# EAGLE design Flight_Computer_Farsi (EAGLE 9.6.2)

## Sheet 1 of 2
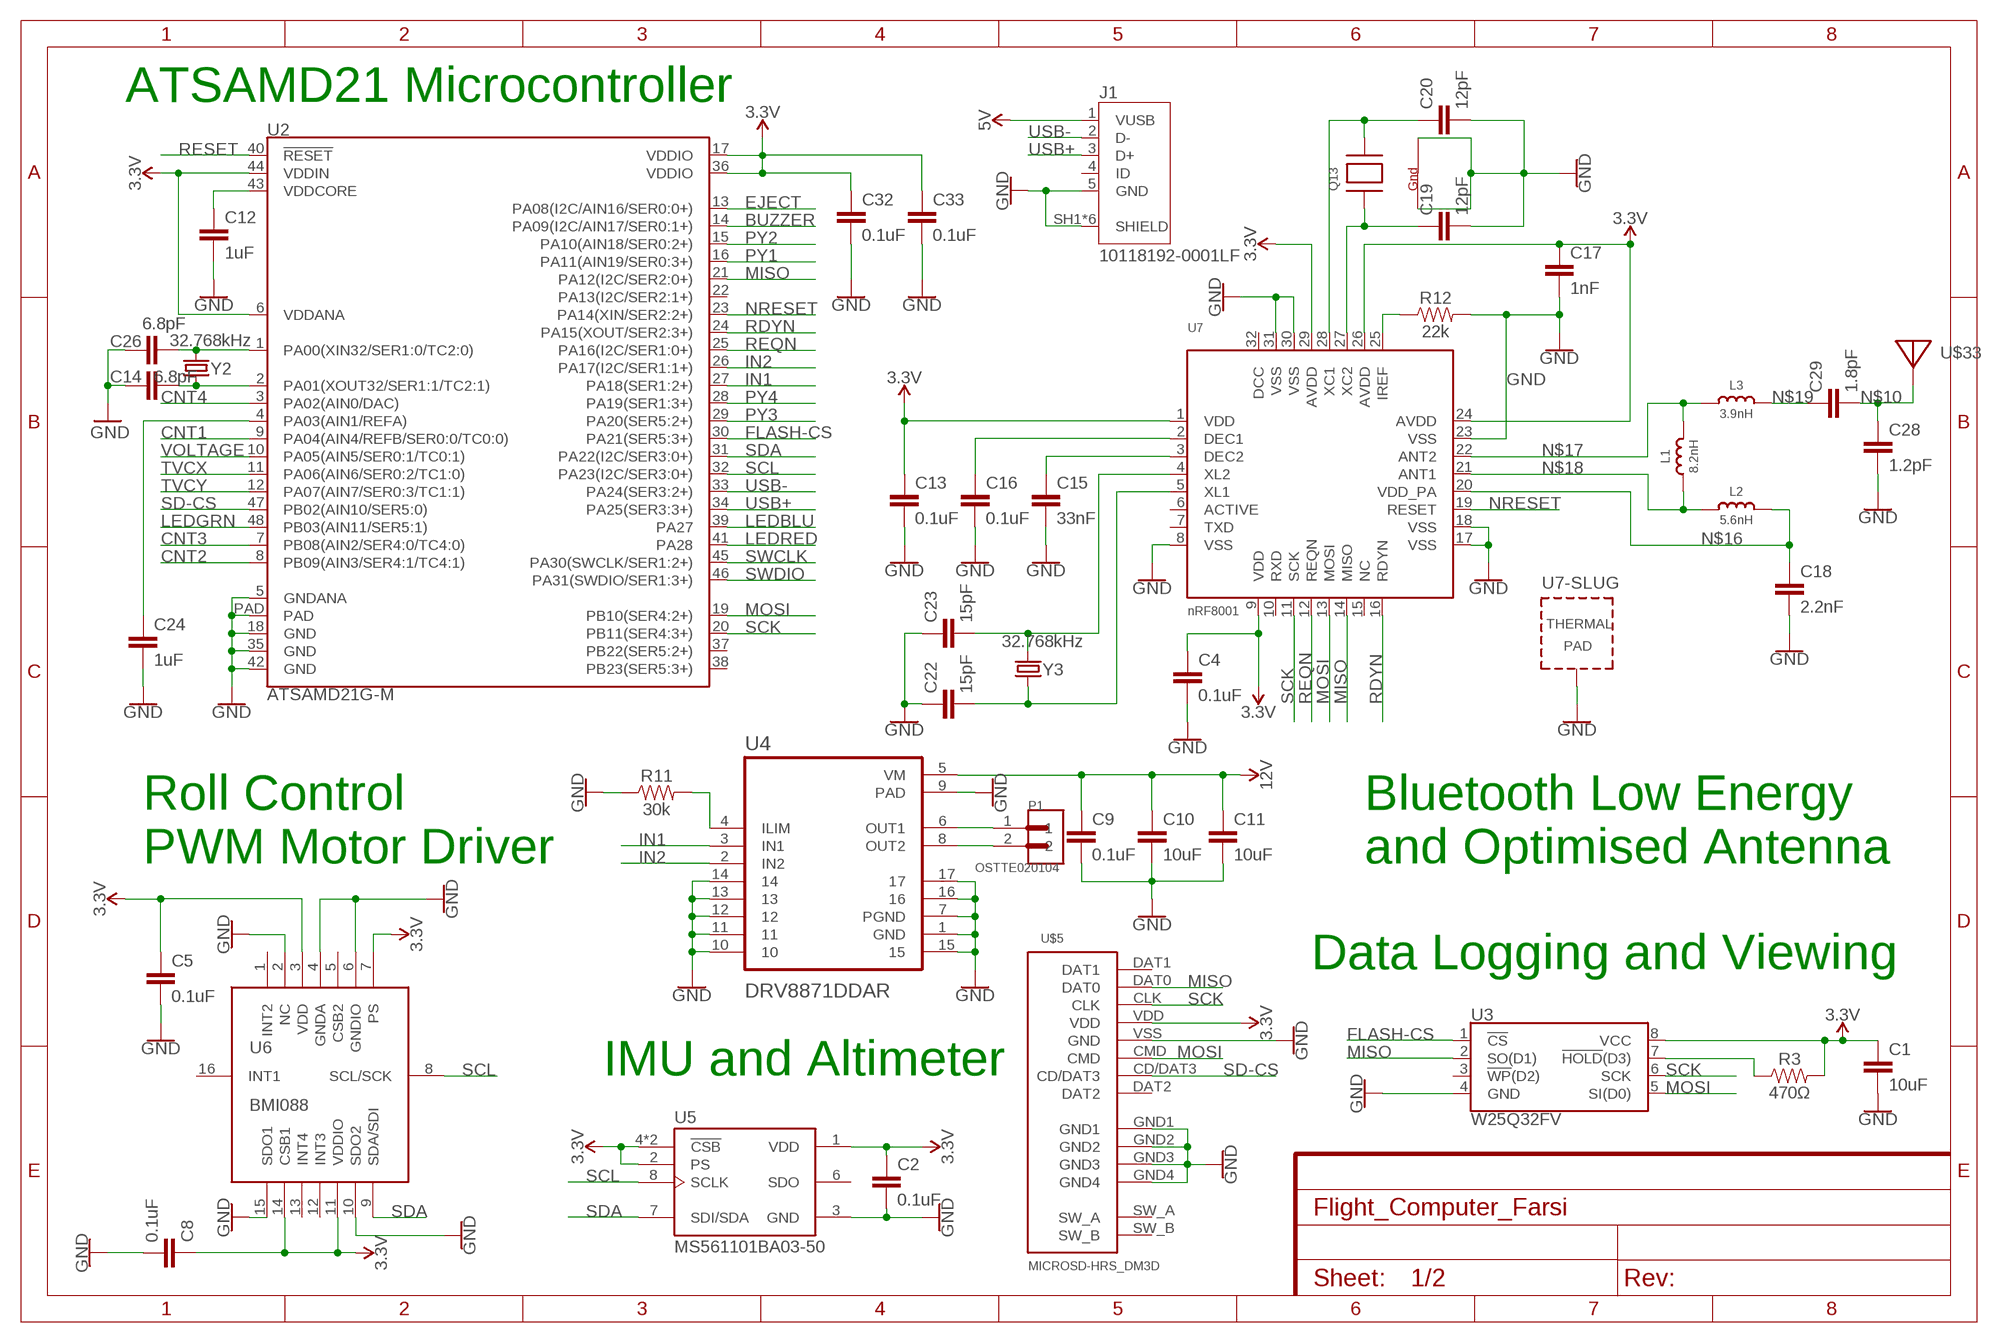
[diagram p0: schematic, sheet 1]

### Parts
C1  10uF  10UF-0603-6.3V-20%  [0603]
C2  0.1uF  0.1UF-0402-16V-10%  [0402]
C4  0.1uF  0.1UF-0402-16V-10%  [0402]
C5  0.1uF  0.1UF-0402-16V-10%  [0402]
C8  0.1uF  0.1UF-0402-16V-10%  [0402]
C9  0.1uF  0.1UF-0603-25V-5%  [0603]
C10  10uF  10UF-0603-6.3V-20%  [0603]
C11  10uF  10UF-0603-6.3V-20%  [0603]
C12  1uF  1.0UF-0603-16V-10%  [0603]
C13  0.1uF  0.1UF-0402-16V-10%  [0402]
C14  6.8pF  0.1UF-0603-25V-(+80/-20%)  [0603]
C15  33nF  0.1UF-0402-16V-10%  [0402]
C16  0.1uF  0.1UF-0402-16V-10%  [0402]
C17  1nF  0.1UF-0402-16V-10%  [0402]
C18  2.2nF  0.1UF-0402-16V-10%  [0402]
C19  12pF  0.1UF-0402-16V-10%  [0402]
C20  12pF  0.1UF-0402-16V-10%  [0402]
C22  15pF  0.1UF-0402-16V-10%  [0402]
C23  15pF  0.1UF-0402-16V-10%  [0402]
C24  1uF  1.0UF-0603-16V-10%  [0603]
C26  6.8pF  0.1UF-0603-25V-(+80/-20%)  [0603]
C28  1.2pF  0.1UF-0402-16V-10%  [0402]
C29  1.8pF  0.1UF-0402-16V-10%  [0402]
C32  0.1uF  0.1UF-0402-16V-10%  [0402]
C33  0.1uF  0.1UF-0402-16V-10%  [0402]
J1  10118192-0001LF  [AMPHENOL_10118192-0001LF]
L1  8.2nH  INDUCTOR_0402  [_0402]
L2  5.6nH  INDUCTOR_0402  [_0402]
L3  3.9nH  INDUCTOR_0402  [_0402]
P1  OSTTE020104  [OST_OSTTE020104]
Q13  XTAL-4-3225  [NX3225]
R3  470Ω  0OHM-0603-1/10W-5%  [0603]
R11  30k  10KOHM-0603-1/10W-1%  [0603]
R12  22k  22OHM-0402-1/10W-1%  [0402]
U2  ATSAMD21G-M  [QFN-48]
U3  W25Q32FV  W25Q32FVSS  [SOIC-8]
U4  DRV8871DDAR  [VREG_LM5017MR/NOPB]
U5  MS561101BA03-50  [SON125P500X300X100-8N]
U6  BMI088  [BMI088]
U7  nRF8001  NRF8001  [QFN32_5MM]
U$5  MICROSD-HRS_DM3D  [DM3D]
U$33  ANTENNA_PCBNRF8001_1.6MM_REV  [ANT_PCB_2.4GHZ_NRF8001_1.6MM_1OZ_REV]
Y2  32.768kHz  CRYSTAL3.2X1.5MM  [CRYSTAL-SMD-3.2X1.5MM]
Y3  32.768kHz  CRYSTAL3.2X1.5MM  [CRYSTAL-SMD-3.2X1.5MM]

### Nets
3.3V: C1.1 C2.1 C4.1 C5.1 C8.1 C13.1 C17.1 C32.1 C33.1 R3.2 U2.6(VDDANA) U2.17(VDDIO) U2.36(VDDIO) U2.44(VDDIN) U3.8(VCC) U5.1(VDD) U5.2(PS) U5.4(!CSB) U5.5(!CSB) U6.3(VDD) U6.7(PS) U6.11(VDDIO) U6.14(CSB1) U7.1(VDD) U7.9(VDD) U7.24(AVDD) U7.26(AVDD) U7.29(AVDD) U$5.VDD ; also sheet 2
5V: J1.1(VUSB) ; also sheet 2
12V: C9.1 C10.1 C11.1 U4.5(VM) ; also sheet 2
BUZZER: U2.14(PA09(I2C/AIN17/SER0:1+)) ; also sheet 2
CNT1: U2.9(PA04(AIN4/REFB/SER0:0/TC0:0)) ; also sheet 2
CNT2: U2.8(PB09(AIN3/SER4:1/TC4:1)) ; also sheet 2
CNT3: U2.7(PB08(AIN2/SER4:0/TC4:0)) ; also sheet 2
CNT4: U2.3(PA02(AIN0/DAC)) ; also sheet 2
EJECT: U2.13(PA08(I2C/AIN16/SER0:0+)) ; also sheet 2
FLASH-CS: U2.30(PA21(SER5:3+)) U3.1(!CS!)
GND: C1.2 C2.2 C4.2 C5.2 C8.2 C9.2 C10.2 C11.2 C12.2 C13.2 C14.1 C15.2 C16.2 C17.2 C18.2 C19.2 C20.2 C22.1 C23.1 C24.2 C26.1 C28.2 C32.2 C33.2 J1.5(GND) J1.SH1(SHIELD) J1.SH2(SHIELD) J1.SH3(SHIELD) J1.SH4(SHIELD) J1.SH5(SHIELD) J1.SH6(SHIELD) Q13.2(G2) Q13.4(G1) R11.1 R12.2 U2.5(GNDANA) U2.18(GND) U2.35(GND) U2.42(GND) U2.PAD U3.4(GND) U4.1(GND) U4.7(PGND) U4.9(PAD) U4.10 U4.11 U4.12 U4.13 U4.14 U4.15 U4.16 U4.17 U5.3(GND) U6.2(NC) U6.4(GNDA) U6.6(GNDIO) U6.10(SDO2) U6.15(SDO1) U7.8(VSS) U7.17(VSS) U7.18(VSS) U7.23(VSS) U7.30(VSS) U7.31(VSS) U7.33(TP) U$5.GND1 U$5.GND2 U$5.GND3 U$5.GND4 U$5.VSS(GND) ; also sheet 2
IN1: U2.27(PA18(SER1:2+)) U4.3(IN1)
IN2: U2.26(PA17(I2C/SER1:1+)) U4.2(IN2)
LEDBLU: U2.39(PA27) ; also sheet 2
LEDGRN: U2.48(PB03(AIN11/SER5:1)) ; also sheet 2
LEDRED: U2.41(PA28) ; also sheet 2
MISO: U2.21(PA12(I2C/SER2:0+)) U3.2(SO(D1)) U7.14(MISO) U$5.DAT0
MOSI: U2.19(PB10(SER4:2+)) U3.5(SI(D0)) U7.13(MOSI) U$5.CMD
N$1: R3.1 U3.7(!HOLD!(D3))
N$3: C12.1 U2.43(VDDCORE)
N$8: R11.2 U4.4(ILIM)
N$9: P1.1 U4.6(OUT1)
N$10: C28.1 C29.2 U$33.FEED
N$12: P1.2 U4.8(OUT2)
N$13: C15.1 U7.3(DEC2)
N$14: C16.1 U7.2(DEC1)
N$15: R12.1 U7.25(IREF)
N$16: C18.1 L2.2 U7.20(VDD_PA)
N$17: L1.2 L3.1 U7.22(ANT2)
N$18: L1.1 L2.1 U7.21(ANT1)
N$19: C29.1 L3.2
N$21: C20.1 Q13.3(X2) U7.28(XC1)
N$22: C19.1 Q13.1(X1) U7.27(XC2)
N$23: C23.2 U7.4(XL2) Y3.P$2
N$24: C22.2 U7.5(XL1) Y3.P$1
N$30: C24.1 U2.4(PA03(AIN1/REFA))
N$45: C26.2 U2.1(PA00(XIN32/SER1:0/TC2:0)) Y2.P$2
N$46: C14.2 U2.2(PA01(XOUT32/SER1:1/TC2:1)) Y2.P$1
NRESET: U2.23(PA14(XIN/SER2:2+)) U7.19(RESET)
PY1: U2.16(PA11(AIN19/SER0:3+)) ; also sheet 2
PY2: U2.15(PA10(AIN18/SER0:2+)) ; also sheet 2
PY3: U2.29(PA20(SER5:2+)) ; also sheet 2
PY4: U2.28(PA19(SER1:3+)) ; also sheet 2
RDYN: U2.24(PA15(XOUT/SER2:3+)) U7.16(RDYN)
REQN: U2.25(PA16(I2C/SER1:0+)) U7.12(REQN)
RESET: U2.40(!RESET!) ; also sheet 2
SCK: U2.20(PB11(SER4:3+)) U3.6(SCK) U7.11(SCK) U$5.CLK
SCL: U2.32(PA23(I2C/SER3:0+)) U5.8(SCLK) U6.8(SCL/SCK) ; also sheet 2
SD-CS: U2.47(PB02(AIN10/SER5:0)) U$5.CD/DAT3
SDA: U2.31(PA22(I2C/SER3:0+)) U5.7(SDI/SDA) U6.9(SDA/SDI) ; also sheet 2
SWCLK: U2.45(PA30(SWCLK/SER1:2+)) ; also sheet 2
SWDIO: U2.46(PA31(SWDIO/SER1:3+)) ; also sheet 2
TVCX: U2.11(PA06(AIN6/SER0:2/TC1:0)) ; also sheet 2
TVCY: U2.12(PA07(AIN7/SER0:3/TC1:1)) ; also sheet 2
USB+: J1.3(D+) U2.34(PA25(SER3:3+)) ; also sheet 2
USB-: J1.2(D-) U2.33(PA24(SER3:2+)) ; also sheet 2
VOLTAGE: U2.10(PA05(AIN5/SER0:1/TC0:1)) ; also sheet 2
Unconnected: J1.4(ID) U2.22(PA13(I2C/SER2:1+)) U2.37(PB22(SER5:2+)) U2.38(PB23(SER5:3+)) U3.3(!WP!(D2)) U5.6(SDO) U6.1(INT2) U6.5(CSB2) U6.12(INT3) U6.13(INT4) U6.16(INT1) U7.6(ACTIVE) U7.7(TXD) U7.10(RXD) U7.15(NC) U7.32(DCC) U$5.DAT1 U$5.DAT2 U$5.SW_A U$5.SW_B

### Notes on the sheet
- ATSAMD21 Microcontroller
- Roll Control
  PWM Motor Driver
- Bluetooth Low Energy 
  and Optimised Antenna
- Data Logging and Viewing
- IMU and Altimeter

## Sheet 2 of 2
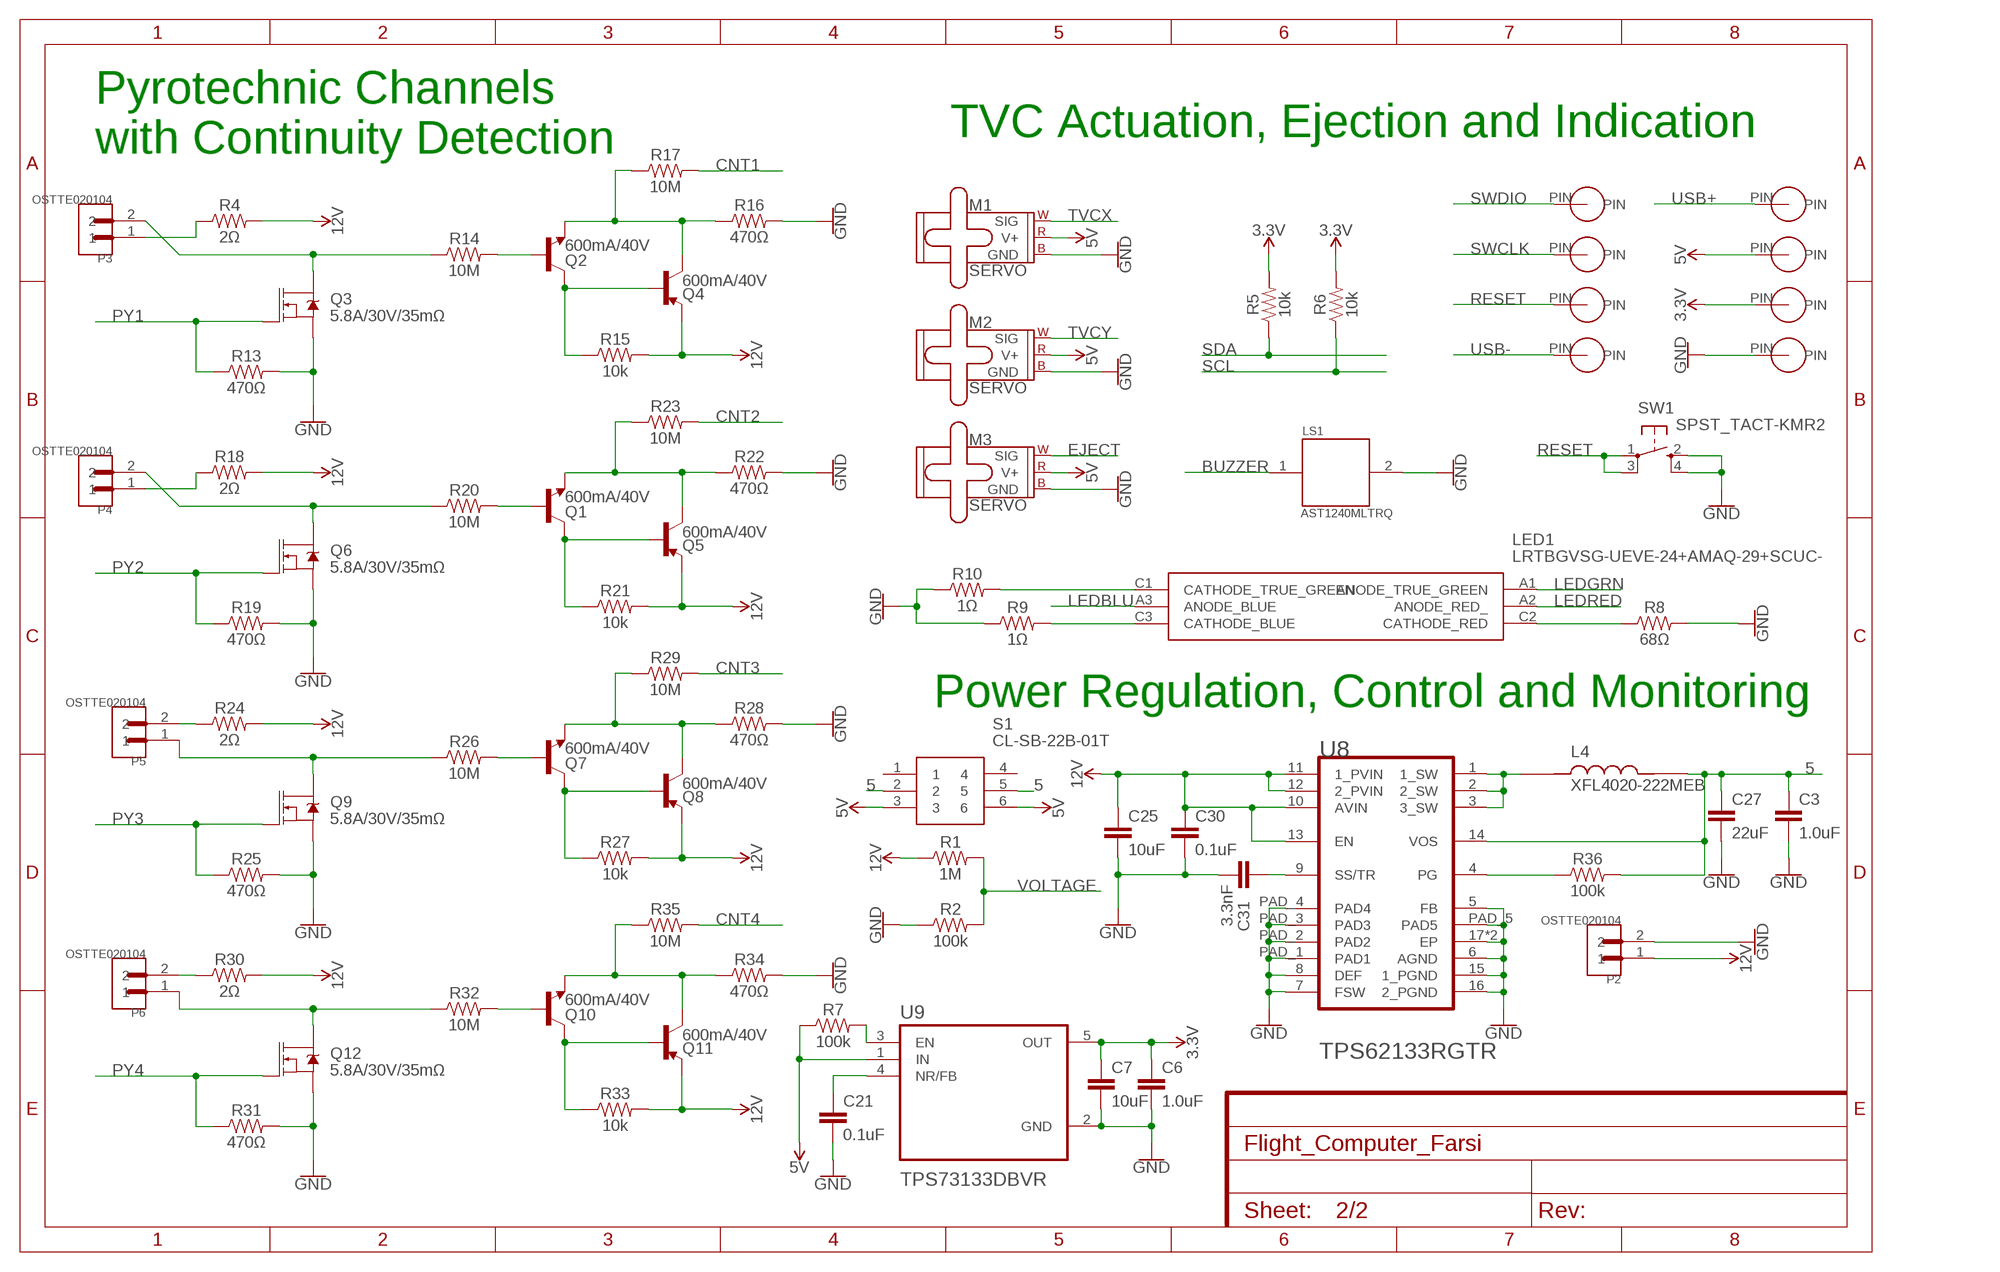
[diagram p1: schematic, sheet 2]

### Parts
C3  1.0uF  1.0UF-0603-16V-10%  [0603]
C6  1.0uF  1.0UF-0603-16V-10%  [0603]
C7  10uF  10UF-0603-6.3V-20%  [0603]
C21  0.1uF  0.1UF-0603-25V-5%  [0603]
C25  10uF  10UF-1210-50V-20%  [1210]
C27  22uF  22UF-0805-6.3V-20%  [0805]
C30  0.1uF  0.1UF-0603-25V-5%  [0603]
C31  3.3nF  3.3NF-0603-100V-10%  [0603]
L4  XFL4020-222MEB  [IND_XFL4020-222MEB]
LED1  LRTBGVSG-UEVE-24+AMAQ-29+SCUC-  [LRTBGVSGUEVE24AMAQ29SCUCHR]
LS1  AST1240MLTRQ  [SPKR_AST1240MLTRQ]
M1  SERVO  [1X03]
M2  SERVO  [1X03]
M3  SERVO  [1X03]
P2  OSTTE020104  [OST_OSTTE020104]
P3  OSTTE020104  [OST_OSTTE020104]
P4  OSTTE020104  [OST_OSTTE020104]
P5  OSTTE020104  [OST_OSTTE020104]
P6  OSTTE020104  [OST_OSTTE020104]
Q1  600mA/40V  TRANS_NPN-MMBT2222AL  [SOT23-3]
Q2  600mA/40V  TRANS_NPN-MMBT2222AL  [SOT23-3]
Q3  5.8A/30V/35mΩ  MOSFET-NCH-AO3404A  [SOT23-3]
Q4  600mA/40V  TRANS_PNP-MMBT4403  [SOT23-3]
Q5  600mA/40V  TRANS_PNP-MMBT4403  [SOT23-3]
Q6  5.8A/30V/35mΩ  MOSFET-NCH-AO3404A  [SOT23-3]
Q7  600mA/40V  TRANS_NPN-MMBT2222AL  [SOT23-3]
Q8  600mA/40V  TRANS_PNP-MMBT4403  [SOT23-3]
Q9  5.8A/30V/35mΩ  MOSFET-NCH-AO3404A  [SOT23-3]
Q10  600mA/40V  TRANS_NPN-MMBT2222AL  [SOT23-3]
Q11  600mA/40V  TRANS_PNP-MMBT4403  [SOT23-3]
Q12  5.8A/30V/35mΩ  MOSFET-NCH-AO3404A  [SOT23-3]
R1  1M  0OHM-0603-1/10W-5%  [0603]
R2  100k  0OHM-0603-1/10W-5%  [0603]
R4  2Ω  0OHM-0603-1/10W  [0603]
R5  10k  22OHM-0402-1/10W-1%  [0402]
R6  10k  22OHM-0402-1/10W-1%  [0402]
R7  100k  0OHM-0603-1/10W-5%  [0603]
R8  68Ω  22OHM-0402-1/10W-1%  [0402]
R9  1Ω  22OHM-0402-1/10W-1%  [0402]
R10  1Ω  22OHM-0402-1/10W-1%  [0402]
R13  470Ω  0OHM-0603-1/10W-5%  [0603]
R14  10M  0OHM-0603-1/10W-5%  [0603]
R15  10k  0OHM-0603-1/10W-5%  [0603]
R16  470Ω  0OHM-0603-1/10W-5%  [0603]
R17  10M  0OHM-0603-1/10W-5%  [0603]
R18  2Ω  0OHM-0603-1/10W  [0603]
R19  470Ω  0OHM-0603-1/10W-5%  [0603]
R20  10M  0OHM-0603-1/10W-5%  [0603]
R21  10k  0OHM-0603-1/10W-5%  [0603]
R22  470Ω  0OHM-0603-1/10W-5%  [0603]
R23  10M  0OHM-0603-1/10W-5%  [0603]
R24  2Ω  0OHM-0603-1/10W  [0603]
R25  470Ω  0OHM-0603-1/10W-5%  [0603]
R26  10M  0OHM-0603-1/10W-5%  [0603]
R27  10k  0OHM-0603-1/10W-5%  [0603]
R28  470Ω  0OHM-0603-1/10W-5%  [0603]
R29  10M  0OHM-0603-1/10W-5%  [0603]
R30  2Ω  0OHM-0603-1/10W  [0603]
R31  470Ω  0OHM-0603-1/10W-5%  [0603]
R32  10M  0OHM-0603-1/10W-5%  [0603]
R33  10k  0OHM-0603-1/10W-5%  [0603]
R34  470Ω  0OHM-0603-1/10W-5%  [0603]
R35  10M  0OHM-0603-1/10W-5%  [0603]
R36  100k  100KOHM-0603-1/10W-1%  [0603]
S1  CL-SB-22B-01T  [CLSB22B01T]
SW1  SPST_TACT-KMR2  [KMR2]
U8  TEXAS_INSTRUMENTS_TPS62133RGTRTEXAS_INSTRUMENTS_TPS62133RGTR_0_0  [TEXAS_INSTRUMENTS_TPS62133RGTR_0]
U9  TPS73133DBVR  [SOT95P280X145-5N]
U$8  CONTACT  [CONTACT]
U$9  CONTACT  [CONTACT]
U$10  CONTACT  [CONTACT]
U$11  CONTACT  [CONTACT]
U$12  CONTACT  [CONTACT]
U$13  CONTACT  [CONTACT]
U$14  CONTACT  [CONTACT]
U$15  CONTACT  [CONTACT]

### Nets
3.3V: C6.1 C7.1 R5.2 R6.2 U9.5(OUT) U$14.PIN ; also sheet 1
5: C3.1 C27.1 L4.2 R36.2 S1.2 S1.5 U8.14(VOS)
5V: M1.2(V+) M2.2(V+) M3.2(V+) R7.1 S1.3 S1.6 U9.1(IN) U$13.PIN ; also sheet 1
12V: C25.1 C30.1 P2.1 Q4.2(E) Q5.2(E) Q8.2(E) Q11.2(E) R1.1 R4.2 R15.2 R18.2 R21.2 R24.2 R27.2 R30.2 R33.2 U8.10(AVIN) U8.11(1_PVIN) U8.12(2_PVIN) U8.13(EN) ; also sheet 1
BUZZER: LS1.1 ; also sheet 1
CNT1: R17.2 ; also sheet 1
CNT2: R23.2 ; also sheet 1
CNT3: R29.2 ; also sheet 1
CNT4: R35.2 ; also sheet 1
EJECT: M3.1(SIG) ; also sheet 1
GND: C3.2 C6.2 C7.2 C21.2 C25.2 C27.2 C30.2 C31.2 LS1.2 M1.3(GND) M2.3(GND) M3.3(GND) P2.2 Q3.2(S) Q6.2(S) Q9.2(S) Q12.2(S) R2.1 R8.2 R9.1 R10.1 R13.2 R16.2 R19.2 R22.2 R25.2 R28.2 R31.2 R34.2 SW1.2(S) SW1.4(S1) U8.5(FB) U8.6(AGND) U8.7(FSW) U8.8(DEF) U8.15(1_PGND) U8.16(2_PGND) U8.17(EP) U8.17-2(EP) U8.PAD_1(PAD1) U8.PAD_2(PAD2) U8.PAD_3(PAD3) U8.PAD_4(PAD4) U8.PAD_5(PAD5) U9.2(GND) U$12.PIN ; also sheet 1
LEDBLU: LED1.A3(ANODE_BLUE) ; also sheet 1
LEDGRN: LED1.A1(ANODE_TRUE_GREEN) ; also sheet 1
LEDRED: LED1.A2(ANODE_RED_) ; also sheet 1
N$2: R7.2 U9.3(EN)
N$4: C21.1 U9.4(NR/FB)
N$5: LED1.C1(CATHODE_TRUE_GREEN) R10.2
N$6: LED1.C3(CATHODE_BLUE) R9.2
N$7: LED1.C2(CATHODE_RED) R8.1
N$20: P4.1 R18.1
N$25: P3.1 R4.1
N$26: P3.2 Q3.3(D) R14.1
N$27: Q2.1(B) R14.2
N$28: Q2.3(C) Q4.1(B) R15.1
N$29: Q2.2(E) Q4.3(C) R16.1 R17.1
N$31: L4.1 U8.1(1_SW) U8.2(2_SW) U8.3(3_SW)
N$33: R36.1 U8.4(PG)
N$34: C31.1 U8.9(SS/TR)
N$35: P4.2 Q6.3(D) R20.1
N$36: Q1.1(B) R20.2
N$37: Q1.3(C) Q5.1(B) R21.1
N$38: Q1.2(E) Q5.3(C) R22.1 R23.1
N$40: P5.1 Q9.3(D) R26.1
N$41: Q7.1(B) R26.2
N$42: Q7.3(C) Q8.1(B) R27.1
N$43: Q7.2(E) Q8.3(C) R28.1 R29.1
N$44: P5.2 R24.1
N$47: P6.1 Q12.3(D) R32.1
N$48: Q10.1(B) R32.2
N$49: Q10.3(C) Q11.1(B) R33.1
N$50: Q10.2(E) Q11.3(C) R34.1 R35.1
N$51: P6.2 R30.1
PY1: Q3.1(G) R13.1 ; also sheet 1
PY2: Q6.1(G) R19.1 ; also sheet 1
PY3: Q9.1(G) R25.1 ; also sheet 1
PY4: Q12.1(G) R31.1 ; also sheet 1
RESET: SW1.1(P) SW1.3(P1) U$10.PIN ; also sheet 1
SCL: R6.1 ; also sheet 1
SDA: R5.1 ; also sheet 1
SWCLK: U$9.PIN ; also sheet 1
SWDIO: U$8.PIN ; also sheet 1
TVCX: M1.1(SIG) ; also sheet 1
TVCY: M2.1(SIG) ; also sheet 1
USB+: U$15.PIN ; also sheet 1
USB-: U$11.PIN ; also sheet 1
VOLTAGE: R1.2 R2.2 ; also sheet 1
Unconnected: S1.1 S1.4

### Notes on the sheet
- TVC Actuation, Ejection and Indication
- Pyrotechnic Channels 
  with Continuity Detection
- Power Regulation, Control and Monitoring

## Library data of the parts
C1 C7 C10 C11 = SparkFun-Capacitors:10UF: 10.0µF ceramic capacitors A capacitor is a passive two-terminal electrical component used to store electrical energy temporarily in an electric field.; PROD_ID: CAP-11015
C2 C4 C5 C8 C13 C16 C32 C33 = SparkFun-Capacitors:0.1UF: 0.1µF ceramic capacitors A capacitor is a passive two-terminal electrical component used to store electrical energy temporarily in an electric field.; PROD_ID: CAP-12416
C3 C6 = SparkFun-Capacitors:1.0UF: 1µF ceramic capacitors A capacitor is a passive two-terminal electrical component used to store electrical energy temporarily in an electric field.; PROD_ID: CAP-00868
C9 C21 C30 = SparkFun-Capacitors:0.1UF: 0.1µF ceramic capacitors A capacitor is a passive two-terminal electrical component used to store electrical energy temporarily in an electric field.; PROD_ID: CAP-08604
C12 C24 = SparkFun-Capacitors:1.0UF: 1µF ceramic capacitors A capacitor is a passive two-terminal electrical component used to store electrical energy temporarily in an electric field.; PROD_ID: CAP-00868; VALUE: 1.0uF
C14 C26 = SparkFun-Capacitors:0.1UF: 0.1µF ceramic capacitors A capacitor is a passive two-terminal electrical component used to store electrical energy temporarily in an electric field.; PROD_ID: CAP-00810; VALUE: 0.1uF
C15 C17-C20 C22 C23 C28 C29 = SparkFun-Capacitors:0.1UF: 0.1µF ceramic capacitors A capacitor is a passive two-terminal electrical component used to store electrical energy temporarily in an electric field.; PROD_ID: CAP-12416; VALUE: 0.1uF
C25 = SparkFun-Capacitors:10UF: 10.0µF ceramic capacitors A capacitor is a passive two-terminal electrical component used to store electrical energy temporarily in an electric field.; PROD_ID: CAP-09824
C27 = SparkFun-Capacitors:22UF: 22µF ceramic capacitors A capacitor is a passive two-terminal electrical component used to store electrical energy temporarily in an electric field.; PROD_ID: CAP-08402
C31 = SparkFun-Capacitors:3.3NF: 3.3nF ceramic capacitors A capacitor is a passive two-terminal electrical component used to store electrical energy temporarily in an electric field.; PROD_ID: CAP-09633
J1 = 10118192-0001LF:10118192-0001LF: Single Port 5 Contact Horizontal Right Angle Shielded Micro B USB 2.0 Connector; AVAILABILITY: Unavailable; DESCRIPTION: USB - micro B USB 2.0 Receptacle Connector 5 Position Surface Mount, Right Angle; DIGIKEY-PURCHASE-URL: https://snapeda.com/shop?store=DigiKey&id=4793801; MF: Amphenol ICC (FCI); MP: 10118192-0001LF; PACKAGE: None; PRICE: None
L1-L3 = microbuilder:INDUCTOR: Inductors 0603: 10nH Ceramic Inductor - microwire antenna/RF (Digikey: 712-1434-2-ND) 0805: 560nH Ceramic Inductor - RF (Digikey: 553-1047-1-ND) 270nH Ceramic Inductor - Q = 40@250MHz, +-5%, 1 Ohm DC Resistance (Digikey: 535-10506-2-ND) 1007 (2518 Metric) SMT: 10µH 10% 250mOhm 820mA 1007 Inductor (Digikey: 587-2189-1-ND) 22µH 10% 500mOhm 580mA 1007 Inductor (Digikey: 587-2190-1-ND) 47µH 10% 950mOhm 420mA 1007 Inductor (Digikey: 587-2191-1-ND) 47µH 5% 100mOhm 1A 1008 Inductor (Digikey: 732-1816-1-ND) 5.0x5.0mm (Taiyo Yuden NR5040 Series) 6.8µH 20% 2.3A 64mOhm Inductor (Digikey: 587-2374-2-ND) 5.0x5.0mm (TDK VLC5045 Series) 4.7µH 20% 3.3A 34mOhm Inductor (Digikey: 445-6526-1-ND) 6.8µH 20% 2.7A 46mOhm Inductor (Digikey: 445-6527-1-ND) 6.0x6.0mm (TDK VLC6045 Series) 4.7µH 20% 3.8A 27mOhm Inductor (Digikey: 445-6538-2-ND) 6.8µH 20% 3A 41mOhm Inductor (Digikey: 445-6540-1-ND) 6.2µH 30% 2.2A 45mOhm Inductor (Digikey: SRR5028-6R2YCT-ND) - Not TDK VLC6045 but footprint should match 6.0x6.0mm (TDK SLF6045 Series) 6.8uH 30% 2A 33mOhm Inductor (Digikey: 445-4572-1-ND, Mouser: 810-SLF645T6R8N2R0PF) 6.0x6.0mm (Sumida CDRH5D28 Series) 6.2uH 30% 1.8A 45mOhm Inductor (Digikey: 308-1542-1-ND) Taiyo Yuden NR3015T2R2M - 2.2uH 20% 1.5A (Digikey: 587-1648-2-ND, Mouser: 963-NR3015T2R2M) - Used with TI TPS62172 CoilCraft RFID Transponder Coil - MA5532-AE (For use with AS3935 Lightning Sensor)
L4 = XFL4020-222MEB:XFL4020-222MEB: Power inductor, shielded, 20% tol, SMT, RoHS, halogen free Check prices <https://snapeda.com/parts/XFL4020-222MEB/Coilcraft/view-part/?ref=eda>; AVAILABILITY: Warning; DESCRIPTION: Power inductor, shielded, 20% tol, SMT, RoHS, halogen free; MF: Coilcraft; MOUSER-PURCHASE-URL: https://snapeda.com/shop?store=Mouser&id=546927; MP: XFL4020-222MEB; PACKAGE: None; PRICE: None
LED1 = LRTBGVSG-UEVE-24+AMAQ-29+SCUC-:LRTBGVSG-UEVE-24+AMAQ-29+SCUC-: Standard LEDs - SMD Red Green Blue Source: Datasheet <https://www.osram.com/ecat/MULTILED LRTBGVSG/com/en/class_pim_web_catalog_103489/global/prd_pim_device_2190789/#tools>; DESCRIPTION: Standard LEDs - SMD Red Green Blue; HEIGHT: 2mm; MANUFACTURER_NAME: OSRAM; MANUFACTURER_PART_NUMBER: LRTBGVSG-UEVE-24+AMAQ-29+SCUC-HR; MOUSER2_PART_NUMBER: 720-LRTBGVSGUEVE24AM; MOUSER2_PRICE-STOCK: https://www.mouser.com/Search/Refine.aspx?Keyword=720-LRTBGVSGUEVE24AM
LS1 = AST1240MLTRQ:AST1240MLTRQ: Audio 25Vp-p 5mA 3Vp-p 75dBA 3500Hz to 4500Hz Screw Screw Mount; AVAILABILITY: Unavailable; DESCRIPTION: Buzzers Transducer, Externally Driven Piezo 3V 5mA 4kHz 75dB @ 3V, 10cm Surface Mount Solder Pads; DIGIKEY-PURCHASE-URL: https://snapeda.com/shop?store=DigiKey&id=480585; MF: Mallory Sonalert; MP: AST1240MLTRQ; PACKAGE: Mallory Sonalert; PRICE: None
M1-M3 = SparkFun-Electromechanical:SERVO: Servo Motor 3-pin connector for a standard servo motor (voltage supply, ground, and control signal.) SparkFun Products Servo - Generic (Sub-Micro Size) <https://www.sparkfun.com/products/9065> (ROB-09065) Servo - Generic High Torque Continuous Rotation (Standard Size) <https://www.sparkfun.com/products/9347> (ROB-09347) Servo - Generic High Torque (Standard Size) <https://www.sparkfun.com/products/11965> (ROB-11965)
P1-P6 = Terminal:OSTTE020104: Terminal Block 3.5mm 2pos Pcb; DESCRIPTION: 2 Position Wire to Board Terminal Block Horizontal with Board 0.138 (3.50mm) Through Hole; DIGI-KEY_PART_NUMBER: ED2740-ND; MF: On Shore; MP: OSTTE020104; PACKAGE: None
Q1 Q2 Q7 Q10 = SparkFun-DiscreteSemi:TRANS_NPN: NPN transistor Current controlled devices typically used to amplify current or used as a switch. BC547 - COM-08928 <http://www.sparkfun.com/products/8928> (TO-92 45V 100mA) (1.Collector 2.Base 3.Emitter) 2N3904 - COM-00521 <http://www.sparkfun.com/products/521> (TO-92 40V 200mA) (1.Emitter 2.Base 3.Collector) P2N2222A - COM-12852 <http://www.sparkfun.com/products/12852> (TO-92 40V 600mA) (1.Collector 2.Base 3.Emitter); PROD_ID: TRANS-08049
Q3 Q6 Q9 Q12 = SparkFun-DiscreteSemi:MOSFET-NCH: N-channel MOSFETs Voltage controlled devices that allow control of high current outputs. SparkFun Products: SparkFun OpenScale <https://www.sparkfun.com/products/13261> SparkFun Digital Sandbox <https://www.sparkfun.com/products/12651> SparkFun Monster Moto Shield <https://www.sparkfun.com/products/10182> SparkFun MOSFET Power Controller <https://www.sparkfun.com/products/11214>; PROD_ID: TRANS-12988
Q4 Q5 Q8 Q11 = SparkFun-DiscreteSemi:TRANS_PNP: PNP transistor Current controlled devices typically used to amplify current or used as a switch. SparkFun Products: SparkFun Serial Enabled 16x2 LCD - Red on Black <https://www.sparkfun.com/products/9068> SparkFun Logomatic <https://www.sparkfun.com/products/12772>; PROD_ID: TRANS-09245
Q13 = adafruit:XTAL-4: Classic 4-pin 3.2 x 2.5mm crystal
R1-R4 R7 R13-R35 = SparkFun-Resistors:0OHM: 0Ω resistor A resistor is a passive two-terminal electrical component that implements electrical resistance as a circuit element. Resistors act to reduce current flow, and, at the same time, act to lower voltage levels within circuits. - Wikipedia; PROD_ID: RES-08609; VALUE: 0
R5 R6 R8-R10 R12 = SparkFun-Resistors:22OHM: 22Ω resistor A resistor is a passive two-terminal electrical component that implements electrical resistance as a circuit element. Resistors act to reduce current flow, and, at the same time, act to lower voltage levels within circuits. - Wikipedia; PROD_ID: RES-12427; VALUE: 22
R11 = SparkFun-Resistors:10KOHM: 10kΩ resistor A resistor is a passive two-terminal electrical component that implements electrical resistance as a circuit element. Resistors act to reduce current flow, and, at the same time, act to lower voltage levels within circuits. - Wikipedia; PROD_ID: RES-00824; VALUE: 10k
R36 = SparkFun-Resistors:100KOHM: 100kΩ resistor A resistor is a passive two-terminal electrical component that implements electrical resistance as a circuit element. Resistors act to reduce current flow, and, at the same time, act to lower voltage levels within circuits. - Wikipedia; PROD_ID: RES-07828
S1 = CL-SB-22B-01T:CL-SB-22B-01T: SWITCH SLIDE DPDT 200MA 12V Source: Datasheet <https://www.nidec-copal-electronics.com/e/catalog/switch/cl-sb.pdf>; DESCRIPTION: SWITCH SLIDE DPDT 200MA 12V; HEIGHT: 5.5mm; MANUFACTURER_NAME: Copal Electronics; MANUFACTURER_PART_NUMBER: CL-SB-22B-01T
SW1 = adafruit:SPST_TACT: SMT 6mm switch, EVQQ2 series http://www.ladyada.net/library/eagle
U2 = SparkFun-IC-Microcontroller:ATSAMD21G: Atmel SAMD21G SMART ARM-Based Microcontroller The Atmel ® | SMART ™ SAM D21 is a series of low-power microcontrollers using the 32-bit ARM ® Cortex ® -M0+ processor, and ranging from 32- to 64-pins with up to 256KB Flash and 32KB of SRAM. The SAM D21 devices operate at a maximum frequency of 48MHz and reach 2.46 CoreMark/MHz. They are designed for simple and intuitive migration with identical peripheral modules, hex compatible code, identical linear address map and pin compatible migration paths between all devices in the product series. All devices include intelligent and flexible peripherals, Atmel Event System for inter-peripheral signaling, and support for capacitive touch button, slider and wheel user interfaces. Datasheet <https://cdn.sparkfun.com/datasheets/Dev/Arduino/Boards/Atmel-42181-SAM-D21_Datasheet.pdf> SparkFun Products SparkFun SAMD21 Mini Breakout <https://www.sparkfun.com/products/13664> (DEV-13664) SparkFun SAMD21 Dev Breakout <https://www.sparkfun.com/products/13672> (DEV-13672); PROD_ID: IC-13064
U3 = SparkFun-IC-Memory:W25Q32FV: W25Q32FV 32Mb (4MB) Serial Flash Memory The W25Q32FV support the standard Serial Peripheral Interface (SPI), Dual/Quad I/O SPI as well as 2-clocks instruction cycle Quad Peripheral Interface (QPI). 104MHz, SPI, 8-SOIC-EIAJ Datasheet <http://www.winbond.com/resource-files/w25q32fv%20revh%20091613.pdf> SparkFun Products SparkFun Blynk Board - ESP8266 <https://www.sparkfun.com/products/13794> (WRL-13794); PROD_ID: IC-13229
U4 = DRV8871DDAR:DRV8871DDAR; AVAILABILITY: Unavailable; DESCRIPTION: 45-V, 3.6-A H-bridge motor driver with integrated current sensing 8-SO PowerPAD -40 to 125; MF: Texas Instruments; MP: DRV8871DDAR; PACKAGE: HSOIC-8 Texas Instruments; PRICE: None; TEXAS_INSTRUMENTS-PURCHASE-URL: https://snapeda.com/shop?store=Texas+Instruments&id=492651
U5 = MS561101BA03-50:MS561101BA03-50: BAROMETRIC PRESSURE SENSOR; ARROW_ELECTRONICS-PURCHASE-URL: https://snapeda.com/shop?store=Arrow+Electronics&id=213247; COMMENT: MS561101BA03-50; DESCRIPTION: Pressure Sensor 1.44V to 3.6V 0.01bar to 1.2bar Absolute 8-Pin QFN T/R; DIGI-KEY_PART_NUMBER: 223-1622-1-ND; DIGIKEY-PURCHASE-URL: https://snapeda.com/shop?store=DigiKey&id=213247; EU_ROHS_COMPLIANCE: Compliant; MF: TE Connectivity; MOUSER-PURCHASE-URL: https://snapeda.com/shop?store=Mouser&id=213247; MP: MS561101BA03-50; PACKAGE: SMD-8 TE Connectivity
U6 = BMI088:BMI088: Inertial Measurement Unit Digital Output 2.5V/3.3V Automotive Source: Datasheet <https://ae-bst.resource.bosch.com/media/_tech/media/datasheets/BST-BMI088-DS001-13.pdf>; DESCRIPTION: Inertial Measurement Unit Digital Output 2.5V/3.3V Automotive; HEIGHT: 1.45mm; MANUFACTURER_NAME: Bosch Sensortec; MANUFACTURER_PART_NUMBER: BMI088
U7 = microbuilder:NRF8001: nRF8001 - Bluetooth Low-Energy Transceiver VDD: 1.9-3.6V Temp: -40°C - 85°C
U8 = Texas Instruments - TPS62133RGTR:TEXAS_INSTRUMENTS_TPS62133RGTR: TI-TPS62133RGT16-1700X1700TP; CIIVA_IDS: 1489568; CODE__JEDEC: MO-220; COMPONENT_LINK_2_DESCRIPTION: Package Specification; COMPONENT_LINK_2_URL: http://www.ti.com/litv/pdf/mpqf119g; COMPONENT_LINK_3_DESCRIPTION: URL Link1; COMPONENT_LINK_3_URL: Samples URL:http://www.ti.com/product/tps62133#samples; DATASHEET: http://www.ti.com/general/docs/lit/getliterature.tsp?genericPartNumber=TPS62133&fileType=pdf; DATASHEET_VERSION: SLVSAG7; DUTY_CYCLEMAX: 100; FOOTPRINT_VARIANT_NAME_0: Manufacturer Recommended; IMPORTED: yes; IMPORTED_FROM: vault; IMPORT_TS: 1521859579; IOUT_MAX_A: 3; IQ_TYPM_A: 0.017; MF: Texas Instruments; MOUNTING_TECHNOLOGY: Surface Mount; MPN: TPS62133RGTR; PACKAGE: RGT0016C; PACKAGE_DESCRIPTION: 16-Pin Plastic Quad Flat No-Lead, 3 x 3 mm Body, 0.5 mm Pitch, 1.7 x 1.7 mm Exposed Pad; PACKAGE_VERSION: revH, Oct-2011; PREFIX: U; PRESET_VOUTV: 5; RATING: Catalog; REGULATED_OUTPUTS: 1; RELEASE_DATE: 1464593309; ROHS: Yes; SUB_FAMILY: Step-Down Regulator; SWITCH_CURRENT_LIMITTYPA: 4.2; SYNCHRONOUS_RECTIFICATION: true; TOPOLOGY: Buck; VAULT_GUID: B53D1A37-7AE9-4EA8-BADC-FF8428FFF33F; VAULT_REVISION: 015DBBDD-3397-4736-845A-37AE7F95FDEE; VIN_MAX_V: 17; VIN_MIN_V: 3; VOUT_MAX_V: 5; VOUT_MIN_V: 5
U9 = TPS73133DBVR (1):TPS73133DBVR: Buy Part <https://snapeda.com/parts/TPS73133DBVR/Texas%20Instruments/view-part/?ref=eda>; AVAILABILITY: Good; DESCRIPTION: 150-mA, high-accuracy, ultra-low-dropout voltage regulator with reverse current protection & enable 5-SOT-23 -40 to 125; DIGIKEY-PURCHASE-URL: https://snapeda.com/shop?store=DigiKey&id=1101349; MF: Texas Instruments; MOUSER-PURCHASE-URL: https://snapeda.com/shop?store=Mouser&id=1101349; MP: TPS73133DBVR; PACKAGE: SOT-23-5 Texas Instruments; PRICE: None; TEXAS_INSTRUMENTS-PURCHASE-URL: https://snapeda.com/shop?store=Texas+Instruments&id=1101349
U$5 = SDcard:MICROSD-HRS_DM3D
U$8-U$15 = Contact:CONTACT
U$33 = microbuilder:ANTENNA_PCB: Various pre-calculated PCB Antennas NRF8001 1.6mm 1Oz - 2.4GHz PCB antenna for 1.6mm PCBs with 1oz copper, double-sided boards (no GND plan beneath antenna). See nRF2740 production files for further information and impedance matching network. 868MHz/2.4GHz DUALBAND - Dual 868MHz and 2.4GHz centered antenna based on board #6 of the CC-ANTENNA-DK from Chipcon/TI
Y2 Y3 = samd21-temp:CRYSTAL: Various standard crystals. Proven footprints.; PROD_ID: XTAL-13062

## Board
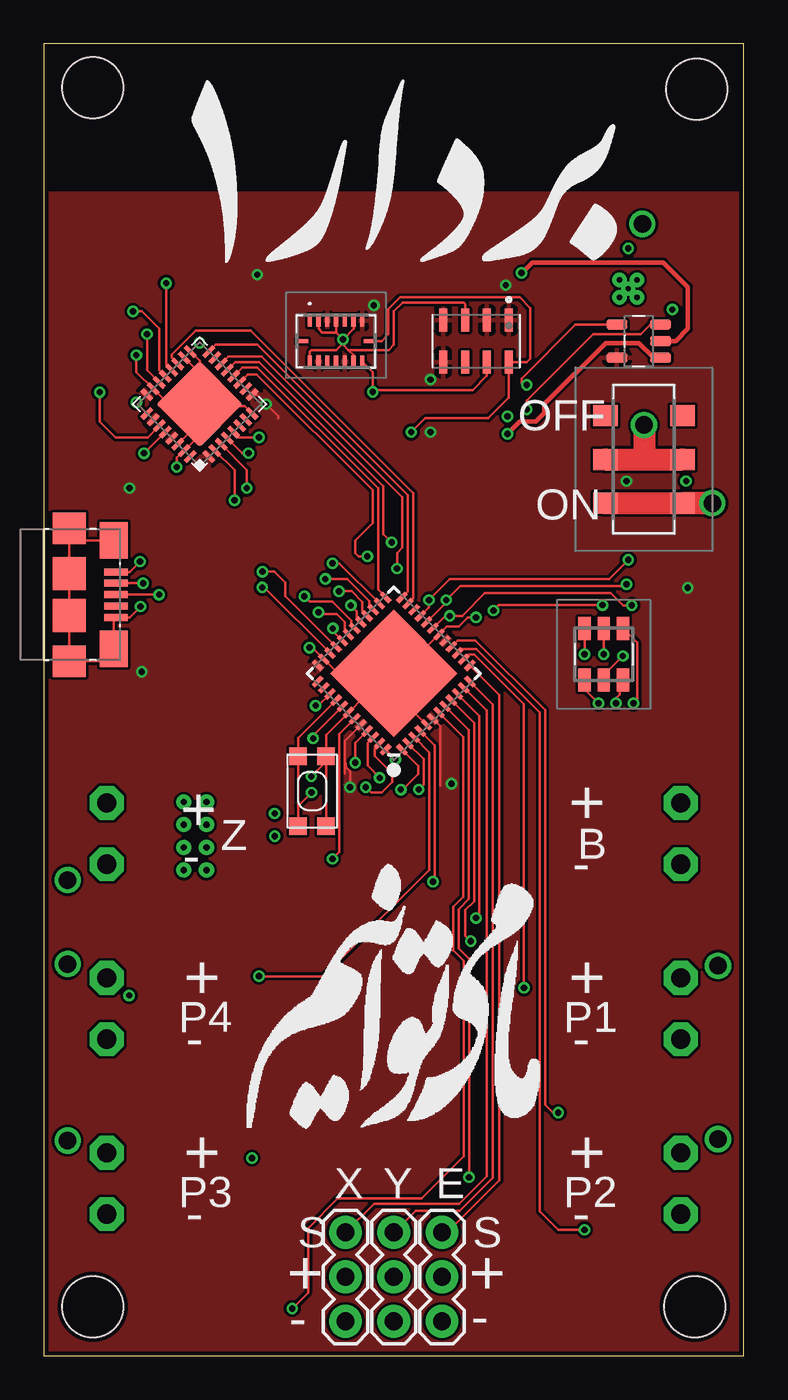
[diagram p2: board, top side]
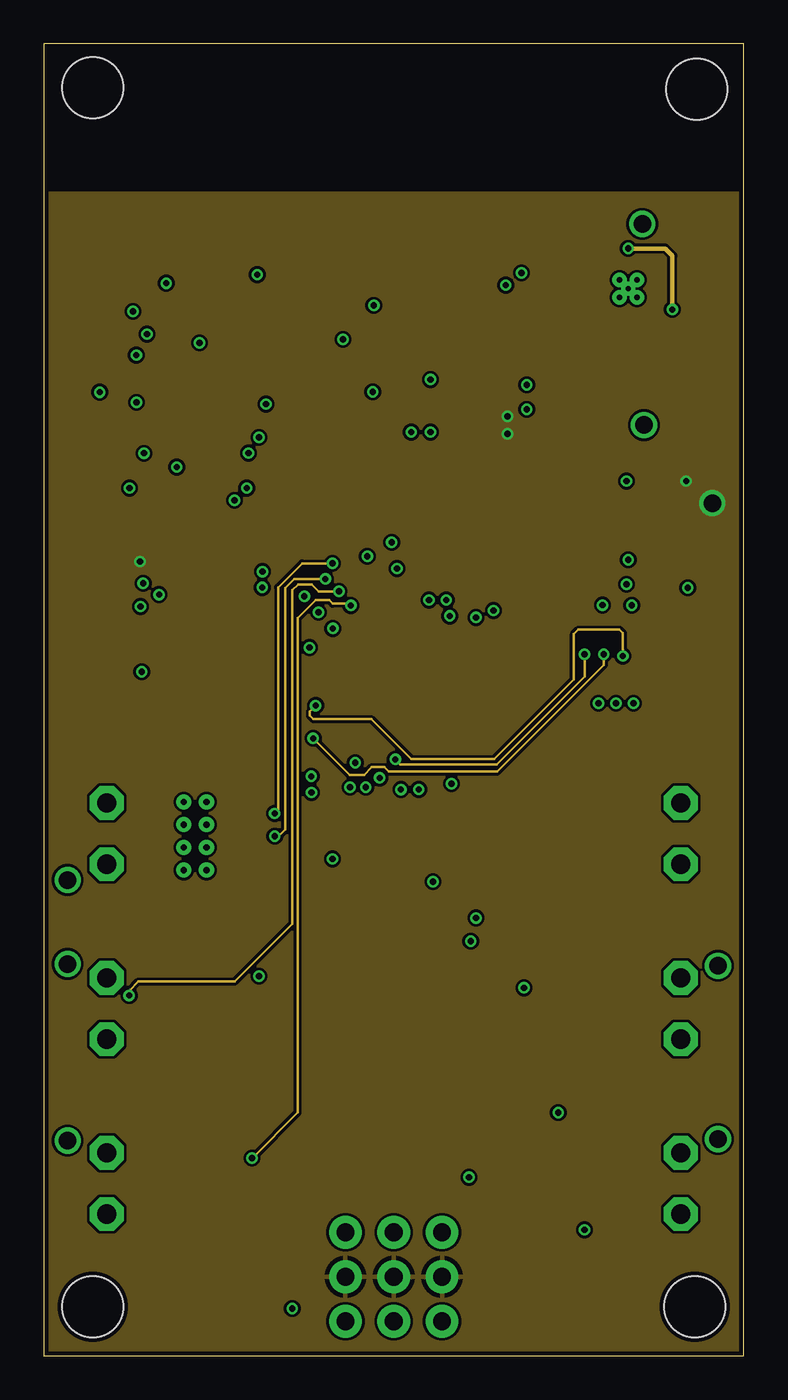
[diagram p3: board, inner layer Route2]
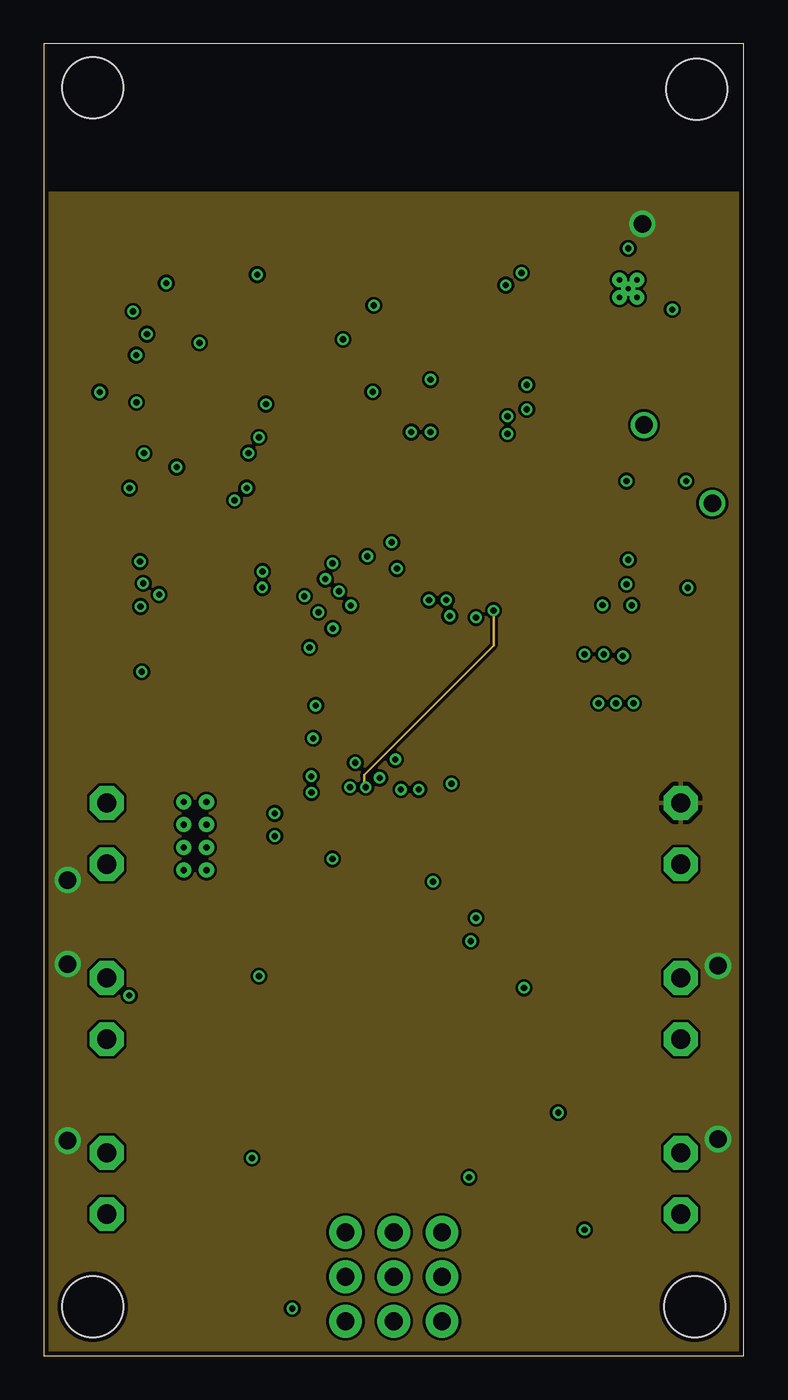
[diagram p4: board, inner layer Route15]
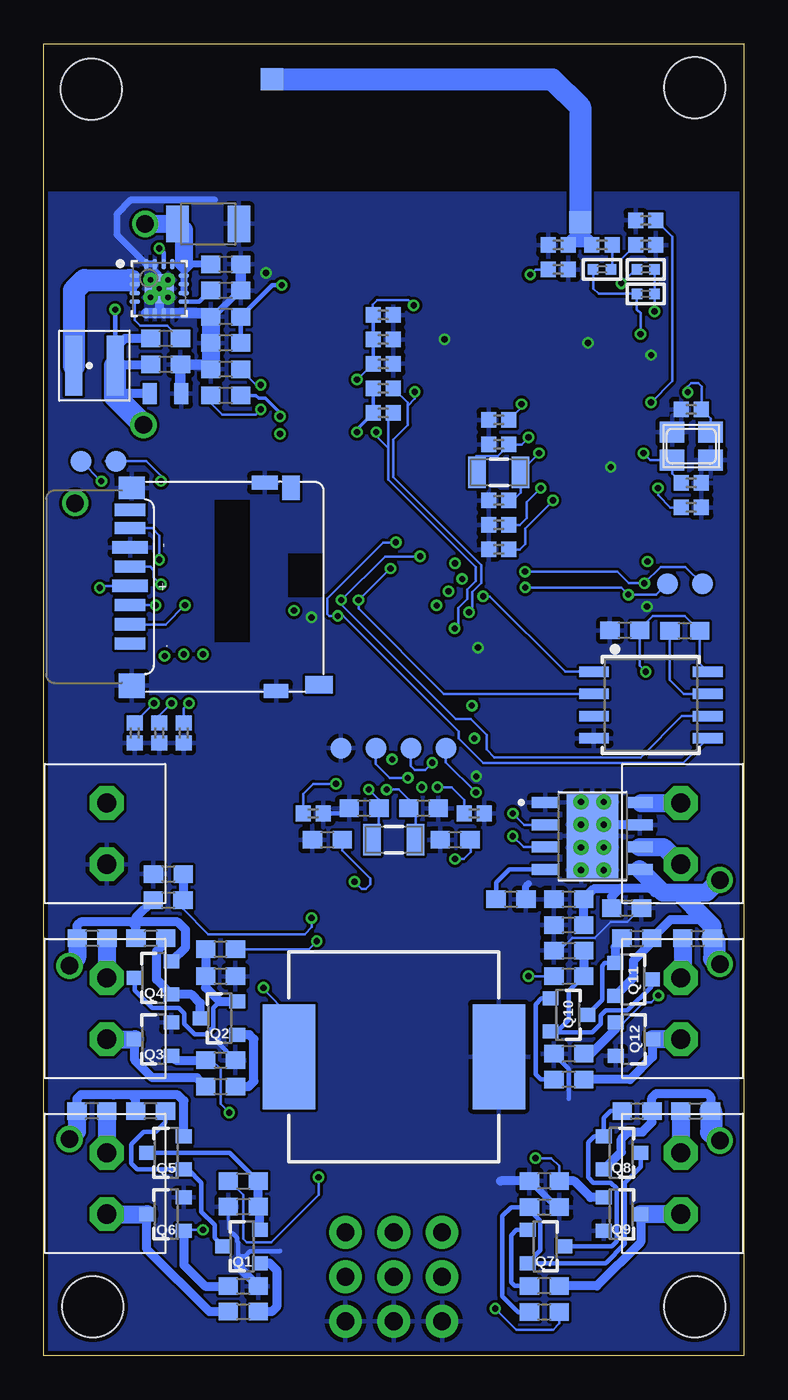
[diagram p5: board, bottom side, seen from below]

Size 40 x 75 mm. Coordinates in mm from the lower left corner, seen from the top.
Outline: 0,0 40,0 40,75 0,75 0,0
Copper layers (1+2*15+16): Top 0.035mm / dielectric 0.213359375mm / Route2 0.035mm / dielectric 1.0161mm / Route15 0.035mm / dielectric 0.213359375mm / Bottom 0.035mm
Design rules "4layercheck *": minimum track width 6mil, minimum drill 0.3mm, track to track 6mil, track to pad 6mil, pad to pad 6mil, via to via 6mil, smd to smd 0mil, copper to edge 10mil, drill to drill 10mil, minimum pad ring 10mil, minimum via ring 6mil, stop-mask expansion 2mil, vias tented up to drill 100mil, thermal gap 10mil
Holes 3.5 mm at 2.8,72.5 37.3,72.4 37.2,2.8 2.8,2.8

### Footprints (pad centres in the part's own frame; a part is rotated, then mirrored left to right if it is on the bottom)
0603 = smd 1.1 x 1: 1 -0.85,0; 2 0.85,0
0402 = smd 0.85 x 0.9: 1 -0.58,0; 2 0.58,0
1210 = smd 1.27 x 2.06: 1 -1.755,0; 2 1.755,0
0805 = smd 0.8 x 1.2: 1 -0.9,0; 2 0.9,0
AMPHENOL_10118192-0001LF = smd 0.4 x 1.35: 1 -1.3,0; 2 -0.65,0; 3 0,0; 4 0.65,0; 5 1.3,0 | smd 2.1 x 1.6: SH1 -3.1,-0.125; SH2 3.1,-0.125 | smd 1.8 x 1.9: SH3 -3.8,-2.675; SH6 3.8,-2.675 | smd 1.9 x 1.9: SH4 -1.2,-2.675; SH5 1.2,-2.675
_0402 = smd 0.6 x 0.6: 1 -0.508,0; 2 0.508,0
IND_XFL4020-222MEB = smd 0.98 x 3.4: 1 -1.185,0; 2 1.185,0
LRTBGVSGUEVE24AMAQ29SCUCHR = smd 0.7 x 1.3: A1 -1.1,1.475; A2 0,1.475; A3 0,-1.475; C1 -1.1,-1.475; C2 1.1,1.475; C3 1.1,-1.475
SPKR_AST1240MLTRQ = smd 3 x 6: 1 -6,0; 2 6,0
1X03 = drill 1.016 pad 1.88: 1 0,0; 2 2.54,0; 3 5.08,0
OST_OSTTE020104 = drill 1.1 pad 1.93 octagon: 1 2.3,3.6; 2 5.8,3.6
SOT23-3 = smd 0.8 x 0.9: 1 -0.95,-1; 2 0.95,-1; 3 0,1.1
NX3225 = smd 1.4 x 1.2: 1 -1.1,-0.8; 2 1.1,-0.8; 3 1.1,0.8; 4 -1.1,0.8
CLSB22B01T = smd 1.2 x 1.4: 1 -2.5,-2.2; 2 0,-2.2; 3 2.5,-2.2; 4 -2.5,2.2; 5 0,2.2; 6 2.5,2.2
KMR2 = smd 1 x 1: 1 2,0.8; 2 2,-0.8; 3 -2,0.8; 4 -2,-0.8
QFN-48 = smd 0.7 x 0.25: 1 -3.4,2.75; 2 -3.4,2.25; 3 -3.4,1.75; 4 -3.4,1.25; 5 -3.4,0.75; 6 -3.4,0.25; 7 -3.4,-0.25; 8 -3.4,-0.75; 9 -3.4,-1.25; 10 -3.4,-1.75; 11 -3.4,-2.25; 12 -3.4,-2.75; 25 3.4,-2.75; 26 3.4,-2.25; 27 3.4,-1.75; 28 3.4,-1.25; 29 3.4,-0.75; 30 3.4,-0.25; 31 3.4,0.25; 32 3.4,0.75; 33 3.4,1.25; 34 3.4,1.75; 35 3.4,2.25; 36 3.4,2.75 | smd 0.25 x 0.7: 13 -2.75,-3.4; 14 -2.25,-3.4; 15 -1.75,-3.4; 16 -1.25,-3.4; 17 -0.75,-3.4; 18 -0.25,-3.4; 19 0.25,-3.4; 20 0.75,-3.4; 21 1.25,-3.4; 22 1.75,-3.4; 23 2.25,-3.4; 24 2.75,-3.4; 37 2.75,3.4; 38 2.25,3.4; 39 1.75,3.4; 40 1.25,3.4; 41 0.75,3.4; 42 0.25,3.4; 43 -0.25,3.4; 44 -0.75,3.4; 45 -1.25,3.4; 46 -1.75,3.4; 47 -2.25,3.4; 48 -2.75,3.4 | smd 5.15 x 5.15: PAD 0,0
SOIC-8 = smd 0.61 x 1.702: 1 -1.905,-3.251; 2 -0.635,-3.251; 3 0.635,-3.251; 4 1.905,-3.251; 5 1.905,3.251; 6 0.635,3.251; 7 -0.635,3.251; 8 -1.905,3.251
VREG_LM5017MR/NOPB = smd 1.55 x 0.6: 1 -2.7,1.905; 2 -2.7,0.635; 3 -2.7,-0.635; 4 -2.7,-1.905; 5 2.7,-1.905; 6 2.7,-0.635; 7 2.7,0.635; 8 2.7,1.905 | smd 2.95 x 4.9: 9 0,0 | drill 0.35 pad 0.61: 10 -0.65,1.95; 11 0.65,1.95; 12 -0.65,0.65; 13 0.65,0.65; 14 -0.65,-0.65; 15 0.65,-0.65; 16 -0.65,-1.95; 17 0.65,-1.95
SON125P500X300X100-8N = smd 1.31 x 0.53: 1 -1.2,1.875; 2 -1.2,0.625; 3 -1.2,-0.625; 4 -1.2,-1.875; 5 1.2,-1.875; 6 1.2,-0.625; 7 1.2,0.625; 8 1.2,1.875
BMI088 = smd 0.25 x 0.675: 1 -1.5,1.165; 2 -1,1.165; 3 -0.5,1.165; 4 0,1.165; 5 0.5,1.165; 6 1,1.165; 7 1.5,1.165; 9 1.5,-1.165; 10 1,-1.165; 11 0.5,-1.165; 12 0,-1.165; 13 -0.5,-1.165; 14 -1,-1.165; 15 -1.5,-1.165 | smd 0.675 x 0.25: 8 1.915,0; 16 -1.915,0
QFN32_5MM = smd 0.8 x 0.25: 1 -2.5,1.75; 2 -2.5,1.25; 3 -2.5,0.75; 4 -2.5,0.25; 5 -2.5,-0.25; 6 -2.5,-0.75; 7 -2.5,-1.25; 8 -2.5,-1.75; 17 2.5,-1.75; 18 2.5,-1.25; 19 2.5,-0.75; 20 2.5,-0.25; 21 2.5,0.25; 22 2.5,0.75; 23 2.5,1.25; 24 2.5,1.75 | smd 0.25 x 0.8: 9 -1.75,-2.5; 10 -1.25,-2.5; 11 -0.75,-2.5; 12 -0.25,-2.5; 13 0.25,-2.5; 14 0.75,-2.5; 15 1.25,-2.5; 16 1.75,-2.5; 25 1.75,2.5; 26 1.25,2.5; 27 0.75,2.5; 28 0.25,2.5; 29 -0.25,2.5; 30 -0.75,2.5; 31 -1.25,2.5; 32 -1.75,2.5 | smd 3.5 x 3.5: 33 0,0
TEXAS_INSTRUMENTS_TPS62133RGTR_0 = smd 0.6 x 0.25: 1 -1.4,0.75; 2 -1.4,0.25; 3 -1.4,-0.25; 4 -1.4,-0.75; 9 1.4,-0.75; 10 1.4,-0.25; 11 1.4,0.25; 12 1.4,0.75 | smd 0.25 x 0.6: 5 -0.75,-1.4; 6 -0.25,-1.4; 7 0.25,-1.4; 8 0.75,-1.4; 13 0.75,1.4; 14 0.25,1.4; 15 -0.25,1.4; 16 -0.75,1.4 | smd 1.7 x 1.7: 17 0,0 | smd 1.55 x 1.55: 17-2 0,0 | drill 0.3 pad 0.5: PAD_1 0,0; PAD_2 0.5,-0.5; PAD_3 0.5,0.5; PAD_4 -0.5,0.5; PAD_5 -0.5,-0.5
SOT95P280X145-5N = smd 1.21 x 0.59: 1 -1.255,0.95; 2 -1.255,0; 3 -1.255,-0.95; 4 1.255,-0.95; 5 1.255,0.95
DM3D = smd 0.7 x 1.75: CD/DAT3 8.15,0.45; CLK 4.85,0.45; CMD 7.05,0.45; DAT0 2.65,0.45; DAT1 1.6,0.45; DAT2 9.25,0.45 | smd 0.8 x 1.5: GND1 0.05,8.15 | smd 0.8 x 1.4: GND2 11.95,8.8 | smd 1.4 x 1.5: GND3 11.65,0.55 | smd 1.3 x 1.5: GND4 0.35,0.55 | smd 1 x 1.55: SW_A 11.6,11.25 | smd 1.4 x 1: SW_B 0.35,9.65 | smd 0.7 x 2.032: VDD 5.95,0.45; VSS 3.75,0.45
CONTACT = smd 1.2 x 1.2: PIN 0.635,0.635
ANT_PCB_2.4GHZ_NRF8001_1.6MM_1OZ_REV = smd 1.27 x 1.27: FEED 0,0; TESTPOINT 8.169,17.605
CRYSTAL-SMD-3.2X1.5MM = smd 1 x 1.8: P$1 -1.25,0; P$2 1.25,0

### Placement (x,y rotation side)
C1  6.8,41.47 180 bottom
C2  20.6,59.5 0 bottom
C3  33.04,56.67 0 bottom
C4  3,48.5 0 bottom
C5  20.6,58.1 0 bottom
C6  29.6,57.9 180 bottom
C7  29.6,59.4 180 bottom
C8  20.6,56.7 0 bottom
C9  10,26.1 180 bottom
C10  10,24.62 180 bottom
C11  6.7,25.6 0 bottom
C12  16.5,29.5 180 bottom
C13  14,53.5 180 bottom
C14  21.7,31.3 0 bottom
C15  14,47.5 180 bottom
C16  14,46.1 180 bottom
C17  10.6,62.1 0 bottom
C18  5.6,63.5 0 bottom
C19  3,54.1 180 bottom
C20  3,49.9 0 bottom
C21  29.6,56.39 180 bottom
C22  14,52.1 0 bottom
C23  14,48.9 0 bottom
C24  23.8,29.5 180 bottom
C25  30.6,64.7 0 bottom
C26  18.3,31.3 180 bottom
C27  33.04,55 0 bottom
C28  10.6,63.5 180 bottom
C29  8.1,63.5 180 bottom
C30  29.6,62.4 0 bottom
C31  29.6,60.9 0 bottom
C32  15.4,31 0 bottom
C33  24.6,31 0 bottom
J1  4.13,43.51 270 top
L1  5.6,60.7 180 bottom
L2  5.6,62.1 180 bottom
L3  8.1,62.1 0 bottom
L4  37.1,56.6 0 bottom
LED1  32,40.1 0 top
LS1  20,17.1 0 bottom
M1  17.24,7.05 270 top
M2  20,7.05 270 top
M3  22.76,7.05 270 top
P1  0,25.8 90 bottom
P2  40,33.9 270 bottom
P3  40,23.9 270 bottom
P4  40,13.9 270 bottom
P5  0,5.8 90 bottom
P6  0,15.8 90 bottom
Q1  28.65,6.25 90 bottom
Q2  29.95,19.3 90 bottom
Q3  33.7,18.1 90 bottom
Q4  33.7,21.6 90 bottom
Q5  33,11.6 90 bottom
Q6  33,8.1 90 bottom
Q7  11.35,6.25 270 bottom
Q8  7,11.6 270 bottom
Q9  7,8.1 270 bottom
Q10  10.05,19.49 270 bottom
Q11  6.35,21.52 270 bottom
Q12  6.32,18.1 270 bottom
Q13  3,52 180 bottom
R1  32.89,26.04 0 bottom
R2  32.88,27.54 0 bottom
R3  3.37,41.44 0 bottom
R4  37.24,23.86 180 bottom
R5  20.6,55.3 180 bottom
R6  20.6,53.9 180 bottom
R7  29.6,54.9 180 bottom
R8  34.8,35.6 270 bottom
R9  33.4,35.6 90 bottom
R10  32,35.6 90 bottom
R11  13.3,26.1 180 bottom
R12  5.6,64.9 180 bottom
R13  29.9,16.9 0 bottom
R14  29.9,15.4 0 bottom
R15  33.88,23.86 180 bottom
R16  29.9,21.7 0 bottom
R17  29.9,23.24 0 bottom
R18  37.25,14 180 bottom
R19  28.6,3.98 0 bottom
R20  28.6,2.52 0 bottom
R21  33.9,14 180 bottom
R22  28.6,8.52 180 bottom
R23  28.6,9.98 180 bottom
R24  2.75,14 0 bottom
R25  11.4,10 180 bottom
R26  11.4,4 180 bottom
R27  6.1,14 0 bottom
R28  11.4,8.5 0 bottom
R29  11.4,2.5 0 bottom
R30  2.64,23.86 0 bottom
R31  10,17.26 180 bottom
R32  10,15.8 180 bottom
R33  6.11,23.86 0 bottom
R34  10,23.16 180 bottom
R35  10,21.7 180 bottom
R36  33.04,58.15 180 bottom
S1  34.29,51.24 270 top
SW1  15.34,32.28 90 top
U2  20,39 135 top
U3  5.31,37.2 270 bottom
U4  8.65,29.71 0 bottom
U5  24.7,58 270 top
U6  16.7,58 0 top
U7  8.9,54.4 135 top
U8  33.4,61 0 bottom
U9  34,58 180 top
U$5  35.52,49.96 270 bottom
U$8  21.65,34.1 0 bottom
U$9  19.65,34.1 0 bottom
U$10  17.65,34.1 0 bottom
U$11  3,43.5 0 bottom
U$12  23.65,34.1 0 bottom
U$13  38.5,50.5 0 bottom
U$14  36.5,50.5 0 bottom
U$15  5,43.5 0 bottom
U$33  9.35,64.8 90 bottom
Y2  20,29.5 0 bottom
Y3  14,50.5 0 bottom

### Tracks (layer width: path | path; a pad name or v marks a point on that pad's centre or on a via)
3.3V  (via drill 0.35)
  Top 0.152: U2.44 17.2,35.14 17.2,33.9 | 17.2,33.9 17.2,33.3 | U7.9 12.17,54.93 v12.7,54.4 13.4,53.7 13.4,53.6 | 17.2,33.9 17.24,33.86 17.24,33.67 17.5,33.41 v17.5,32.5 | U2.6 22.64,36 22.64,32.6
  Bottom 0.152: 21.2,59.52 21.2,60.1 20.95,60.35 19.17,60.35 v18.86,60.04 | U3.8 2.52,39.57 R3.2 3.38,42.3 5.2,42.3 5.95,41.55 C1.1 5.95,39.45 v5.6,39.1 | C13.1 12.7,54.22 v12.7,54.4 | v33.3,50 33.3,50.3 34.13,51.13 U$14.PIN 36.47,51.13 | 35.16,44.1 U$5.VDD 36.69,44.01 v36.8,43.9 | C17.1 11.9,62.1 v12.2,61.8 | C4.1 4.2,48.5 4.9,49.2 v4.9,49.6 | C8.1 22.07,55.81 v22.1,55.81 | C33.1 25.18,32.12 24.6,32.7 v23.3,32.7 | C32.1 15.98,31.78 16.7,32.5 v17.5,32.5
  Bottom 0.203: v22.1,52.8 22.1,52.98 R6.2 R5.2 | C8.1 C5.1 C2.1 21.2,59.52
  Bottom 0.254: C6.1 C7.1 26.95,61.2 v26.4,61.2
  pour Top: 0,66.5 40,66.5 40,0 0,0
5  (via drill 0.35, 1)
  Top 1.27: S1.2 34.2,51.24 | 34.2,51.24 S1.5 | v34.3,53.2 34.3,51.34 34.2,51.24
  Route2 0.254: v33.4,63.3 35.5,63.3 35.92,62.88 v35.92,59.81
  Bottom 0.254: L4.2 35.91,57.6 v35.91,59.8 v35.92,59.81 | U8.14 33.15,63.05 v33.4,63.3
  Bottom 0.508: C3.1 35.84,56.67 L4.2 | R36.2 35.37,58.15 35.91,57.6 | C27.1 35.73,55 35.91,54.81
  Bottom 1.27: L4.2 35.91,54.81 v34.3,53.2
5V  (via drill 0.35, 1)
  Top 0.152: J1.1 4.91,44.81 v5.5,45.4
  Top 0.254: U9.1 34.85,57.05 34,57.9 32.1,57.9 28.6,54.4 28.6,53.9 28.1,53.4 27.2,53.4 v26.5,52.7
  Top 1.27: S1.3 v38.2,48.74 S1.6
  Bottom 0.152: U$13.PIN 36.73,50 v36.71,50
  Bottom 0.203: R7.1 27.89,54.9 27.73,54.73 27.34,54.73 26.5,53.89 v26.5,53.7
  Bottom 0.254: R7.1 28.65,54.8
  pour Route2: 0,66.5 40,66.5 40,0 0,0
12V  (via drill 1)
  Bottom 0.254: 32,61.95 32.45,62.4 U8.13 32.2,62.4 32,62.6
  Bottom 0.406: C30.1 31.55,62.4 32,61.95 U8.12 U8.11 U8.10
  Bottom 0.508: 34.66,23.86 R15.2 34.73,24.53 | 34.73,24.53 35,24.8 | 35,24.8 37.9,24.8 38.1,24.6 R4.2 | R24.2 1.9,14.8 2.1,15 5,15 5.25,14.75 R27.2 5.25,13.35 5.8,12.8 6.6,12.8 7,12.4 7,11.65 Q8.2 7.95,10.6 | Q4.2 31.9,23.35 31.9,24.36 32.34,24.8 35,24.8 | Q5.2 32,14.57 32.33,14.91 35,14.91 | R18.2 38.1,14.7 37.89,14.91 36.02,14.91 36.01,14.91 35,14.91 | R21.2 34.75,14.66 35,14.91 | Q11.2 6.3,21.62 6.3,22.6 5.26,23.64 R33.2 4.18,24.94 2.16,24.94 | C10.1 C9.1 8.54,26.71 7.09,26.71 | U4.5 6.05,27.8 | 4.48,26.47 5.1,26.47 5.33,26.71 7.09,26.71 | 7.09,26.71 7.55,26.25 C11.1 | R1.1 34.73,25.05 34.73,24.53
  Bottom 1.016: v1.37,27.2 1.4,27.2 2.13,26.47 3.7,26.47 | U4.5 4.62,26.47 4.48,26.47 3.7,26.47 | R30.2 1.79,24.56 2.16,24.94 3.7,26.47 | R4.2 38.09,22.74 v38.53,22.29 | R18.2 38.1,12.83 v38.53,12.39 | v34.2,64.7 C25.1 32,64.34 32,62.6
  Bottom 1.27: R24.2 1.87,13.97 1.87,12.8 v1.37,12.3 | R30.2 1.69,23.76 1.69,22.72 v1.37,22.4
  pour Route15: 0,66.5 40,66.5 40,0 0,0
BUZZER  (via drill 0.35)
  Top 0.152: U2.14 24.28,40.1 24.6,40.1 27.44,37.26 v27.44,21.03
  Bottom 0.152: LS1.1 26,19.5 27.44,20.94 v27.44,21.03
CNT1  (via drill 0.35)
  Top 0.152: U2.9 24.59,36.17 24.59,25.98 24.09,25.48 24.09,24.01 v24.4,23.7
  Bottom 0.152: R17.2 24.86,23.24 v24.4,23.7
CNT2  (via drill 0.35)
  Top 0.152: U2.8 24.29,35.77 24.29,26.11 23.7,25.52 23.7,23.3 24.3,22.7 v24.3,10.21
  Bottom 0.152: v24.3,10.21 24.3,9.21 27,6.5 28.4,6.5 28.6,6.7 28.6,9.2 29.38,9.98 R23.2
CNT3  (via drill 0.35)
  Top 0.152: v14.2,2.7 15.1,3.6 15.1,7.3 16.8,9.01 21.61,9.01 24,11.39 24,22.57 23.4,23.17 23.4,25.64 23.98,26.23 23.98,35.37 U2.7
  Bottom 0.152: v14.2,2.7 13,1.5 10.9,1.5 10.55,1.85 R29.2
CNT4  (via drill 0.35)
  Top 0.152: U2.3 22.04,34.49 22.04,27.77 15.97,21.7 v12.3,21.7
  Bottom 0.152: v12.3,21.7 R35.2
EJECT
  Top 0.152: U2.13 26.03,37.78 26.03,10.02 23.06,7.05 M3.1
FLASH-CS  (via drill 0.35)
  Top 0.152: v14.89,43.41 15.2,43.11 16.47,43.11 17.56,42.02 17.56,41.79 U2.30
  Bottom 0.152: v14.89,43.41 14.51,43.41 10.21,39.1 U3.1
GND  (via drill 0.35, 0.35 pad 0.55)
  Top 0.152: 9,54.3 U7.33 | U7.31 8.9,52.63 8.9,53.34 | U7.30 8.38,52.82 | 8.38,52.82 8.9,53.34 | 8.9,53.34 8.9,54.3 | 8.9,54.3 U7.33 | U7.17 8.9,56.88 8.9,56.17 | 8.9,56.17 U7.33 | 8.9,56.17 U7.18 U7.17 | 18.32,37.68 U2.42 16.14,35.49 SW1.2 | 18.32,37.68 19.65,39 U2.PAD | U2.5 20,37.94 U2.PAD | U2.PAD 20.35,39 U2.18 23.04,41.68 23.71,41.68 24.24,42.21 v24.7,42.21 | 18.32,37.68 18.14,37.68 U2.35 15.34,40.48 v15.18,40.48 | SW1.4 SW1.2 | SW1.2 16.14,33.98 v15.29,33.12 | 8.38,52.82 8.38,53.15 U7.23 5.29,56.24 v5.29,57.2 | U7.31 8.02,51.65 | v7.6,50.8 7.6,51.33 U7.31 | J1.SH1 2.15,46.61 J1.SH3 J1.SH4 J1.SH5 J1.SH6 3.31,39.71 J1.SH2 4,42.09 J1.5 4.91,42.21 v5.53,42.83 | U5.3 24.07,60.12 24,60.2 20.5,60.2 20,59.7 20,57.8 19.7,57.5 17.4,57.5 | U7.8 11.47,54.3 8.9,54.3 | U7.17 8.86,57.9 v8.9,57.9 | U6.15 15.2,57.4 15.3,57.5 16.7,57.5 17.1,57.9 v17.1,58.1 | U6.10 17.7,57.2 17.4,57.5 | 17.4,57.5 17.1,57.8 v17.1,58.1 | U6.6 17.7,58.7 v17.1,58.1 | 16.7,58.5 v17.1,58.1 | U6.4 16.7,58.5 | U6.2 15.7,58.7 15.9,58.5 16.7,58.5
  Top 0.254: v27.3,61.9 27.9,62.5 35.4,62.5 36.8,61.1 36.8,58.7 36.1,58 U9.2
  Bottom 0.152: 28.9,5.12 28.9,5.5 28.75,5.65 | 29.2,7 29.45,7.25 R22.2 | U4.9 8.67,29.73 | U4.9 8.65,30.68 | R34.2 10.52,23.16 9.79,23.89 8.51,23.89 7.61,24.79 6.66,24.79 C11.2 | U8.PAD_1 U8.PAD_3 | U4.11 U4.13 U4.9 | U4.17 8.65,28.41 U4.9 | U4.9 8.65,31.01 U4.10 | U4.9 U4.14 U4.16 | U4.9 U4.15 | U4.9 U4.12 | U8.PAD_1 U8.PAD_5 | U8.PAD_1 U8.PAD_4 | U8.PAD_1 U8.PAD_2
  Bottom 0.254: R13.2 30,17.85 30,18.1 | 28.9,5.2 28.9,5.7 | 28.9,5.7 28.9,6.5 28.96,6.55 28.96,6.76 29.2,7 | 28.9,5.7 28.5,5.7 28.22,5.98 26.52,5.98 26.5,6 | R31.2 10,16.41 10,14.7 | U8.PAD_1 33.4,61.85 33.65,62.1 U8.15 | C33.2 22.85,31 C14.1
  Bottom 0.406: R28.2 10.7,8.5 12.2,10 R25.2 | R11.1 12.45,26.85 12.3,27 | C7.2 30.4,59.4 30.3,59.4 28.8,60.9 C31.2 | U8.15 U8.16 35.8,64.05 35.8,65.3 35.01,66.09 30.23,66.09
  Bottom 0.508: R19.2 28.26,4.49 28.27,4.49 28.9,5.12 28.9,5.2 28.8,5.2 | R25.2 13.9,10 | 8.65,30.68 8.38,30.95 | U4.7 8.98,30.34 | U8.PAD_1 33.4,59.85 U8.7
  Bottom 0.61: U8.5 U8.6 U8.7 U8.8 30.6,59.6 30.4,59.4 | C3.2 31.98,56.47 32.14,56.31 | 30.56,56.5 C21.2 30.73,56.67 C3.2 | C31.2 C30.2 28.84,62.49 | C3.2 32.19,55.05 C27.2
  Bottom 1.016: C7.2 C6.2 C21.2
  pour Bottom: 0,66.5 40,66.5 40,0 0,0
IN1  (via drill 0.35)
  Top 0.152: v16.09,44.41 17.34,44.41 18.6,43.15 18.6,42.88 U2.27
  Route2 0.152: v16.09,44.41 14.31,44.41 13.8,43.9 13.8,30.1 13.4,29.7 v13.2,29.7
  Bottom 0.152: v13.2,29.7 12.57,29.07 U4.3
IN2  (via drill 0.35)
  Top 0.152: U2.26 16.88,45.3 v16.5,45.3
  Route2 0.152: v16.5,45.3 14.77,45.3 13.39,43.92 13.39,31.2 v13.19,31
  Bottom 0.152: v13.19,31 12.54,30.34 U4.2
LEDBLU  (via drill 0.35)
  Top 0.152: v15.54,37.16 15.69,37.16 U2.39 | v33.09,40 32,38.91 LED1.A3
  Route2 0.152: v33.09,40 33.09,41.31 32.89,41.51 30.55,41.51 30.29,41.25 30.29,38.66 25.75,34.11 20.99,34.11 18.7,36.4 15.4,36.4 15.2,36.6 15.2,36.83 v15.54,37.16
LEDGRN  (via drill 0.35)
  Top 0.152: U2.48 v20.09,34.1 v20.09,34.09 | v30.9,40.1 LED1.A1
  Route2 0.152: v30.9,40.1 30.9,38.83 25.87,33.8 20.38,33.8 v20.09,34.09
LEDRED  (via drill 0.35)
  Top 0.152: LED1.A2 v32,40.1 | U2.41 15.39,35.46 v15.39,35.3
  Route2 0.152: v15.39,35.3 17.49,33.2 18.3,33.2 18.74,33.64 19.46,33.64 19.7,33.4 25.9,33.4 32,39.5 v32,40.1
MISO  (via drill 0.35)
  Top 0.152: v20.19,45 20.19,45.89 20.49,46.19 20.49,49.07 12.45,57.11 10.55,57.11 U7.14 | U2.21 22.01,42.78 v22.01,43.2 23.21,44.4 32.3,44.4 v33.4,45.5
  Bottom 0.152: v20.19,45 20.21,45 v22.01,43.2 22.01,42.71 17.14,37.84 U3.2 | v33.4,45.5 33.4,46.9 33.81,47.31 U$5.DAT0
MOSI  (via drill 0.35)
  Top 0.152: v19.88,46.5 19.41,46.98 19.41,49.73 12.33,56.8 10.95,56.8 U7.13 | U2.19 22.95,42.3 v23.2,42.3 v23.2,42.29 v23.21,42.3 23.9,42.3 25.19,43.59 32.41,43.59 33.1,42.9 v33.6,42.9
  Bottom 0.152: v19.88,46.5 20.6,46.5 23.8,43.3 23.8,42.4 23.69,42.29 v23.2,42.29 22.9,42.29 16.3,35.69 16.3,35.3 14.9,33.9 3.45,33.9 U3.5 | v33.6,42.9 v33.61,42.91 U$5.CMD
N$1
  Bottom 0.152: U3.7 3.44,37.84 4.22,38.62 R3.1
N$2  (via drill 0.35)
  Top 0.152: v27.6,54.1 27.6,54.6 31.4,58.4 34.1,58.4 34.65,58.95 U9.3
  Bottom 0.152: R7.2 30.45,54.45 29.8,53.8 27.9,53.8 v27.6,54.1
N$3  (via drill 0.35)
  Top 0.152: U2.43 16.89,35.54 16.89,28.79 v16.5,28.4
  Bottom 0.152: v16.5,28.4 16,28.4 15.6,28.8 15.6,29.45 C12.1
N$4  (via drill 0.35)
  Top 0.152: v27.6,55.5 27.4,55.5 27.3,55.6 27.3,55.87 30.38,58.95 U9.4
  Bottom 0.152: C21.1 27.86,55.5 v27.6,55.5
N$5  (via drill 0.35)
  Top 0.152: LED1.C1 30.9,38.1 v31.7,37.3
  Bottom 0.152: v31.7,37.3 32,37 R10.2
N$6  (via drill 0.35)
  Top 0.152: LED1.C3 32.9,38.42 32.9,37.8 32.7,37.6 v32.7,37.3
  Bottom 0.152: R9.2 33.4,36.6 v32.7,37.3
N$7  (via drill 0.35)
  Top 0.152: LED1.C2 33.9,40.77 33.9,37.5 v33.7,37.3
  Bottom 0.152: R8.1 34.8,36.2 v33.7,37.3
N$8
  Bottom 0.254: U4.4 13.39,27.8 14.15,27.05 R11.2
N$9
  Bottom 1.016: U4.6 4.58,29.07 P1.1
N$10
  Bottom 0.254: C29.2 C28.1
  Bottom 0.813: C29.2 9.35,64.17 | C28.1 9.35,64.17 | 9.35,64.17 U$33.FEED
N$12
  Bottom 0.152: U4.8 5.88,31.61 5.87,31.6
  Bottom 1.016: 5.87,31.6 P1.2
N$13  (via drill 0.35 pad 0.55)
  Top 0.152: v11.6,49.6 11.6,50.64 U7.3
  Bottom 0.152: C15.1 12.8,47.5 12.4,47.9 12.4,48.8 v11.6,49.6
N$14  (via drill 0.35 pad 0.55)
  Top 0.152: U7.2 10.9,50.63 v10.9,48.9
  Bottom 0.152: C16.1 12.8,46.1 12.5,46.4 12.5,47.3 v10.9,48.9
N$15  (via drill 0.35 pad 0.55)
  Top 0.152: U7.25 5.3,54.46 v5.3,54.5
  Bottom 0.152: R12.1 4.1,63.98 4.1,55.7 v5.3,54.5
N$16  (via drill 0.35)
  Top 0.152: U7.20 7,56.66 7,57.35 7,57.36 v7,61.31
  Bottom 0.152: C18.1 7,62.68 v7,61.31 6.21,62.1 L2.2
N$17  (via drill 0.35 pad 0.55)
  Top 0.152: U7.22 5.9,56.34 v5.9,58.4
  Bottom 0.152: L3.1 8.61,61.01 8.3,60.7 L1.2 6.11,59.81 5.9,59.6 v5.9,58.4
N$18  (via drill 0.35)
  Top 0.152: U7.21 6.6,56.35 6.6,58.7 5.6,59.7 v5.1,59.7
  Bottom 0.152: v5.1,59.7 L1.1 L2.1
N$19
  Bottom 0.152: L3.2 7.52,62.17 C29.1
N$20
  Bottom 1.016: R18.1 P4.1
N$21  (via drill 0.35 pad 0.55)
  Top 0.152: U7.28 v5.74,51.59 v5.73,51.59
  Bottom 0.152: C20.1 4.1,50.42 Q13.3 5.34,51.2 v5.73,51.59
N$22  (via drill 0.35 pad 0.55)
  Top 0.152: U7.27 5.94,52.5 4.1,52.5 3.2,53.4 v3.2,55.08
  Bottom 0.152: Q13.1 1.9,53.58 C19.1 2.4,54.12 2.4,55.4 2.6,55.6 3,55.6 3.2,55.4 v3.2,55.08
N$23  (via drill 0.35 pad 0.55)
  Top 0.152: U7.4 11.35,51.6 v11.7,51.6
  Bottom 0.152: C23.2 13.2,48.9 12.75,49.35 Y3.P$2 12.75,50.55 v11.7,51.6
N$24  (via drill 0.35 pad 0.55)
  Top 0.152: U7.5 11.15,52.5 v12.3,52.5
  Bottom 0.152: Y3.P$1 15.3,50.55 15.3,51.4 15.28,51.42 14.06,51.42 13.42,52.06 C22.2 12.7,52.1 v12.3,52.5
N$25
  Bottom 1.016: R4.1 P3.1
N$26
  Bottom 0.508: Q3.3 34.8,16.9 33.8,15.9 31.25,15.9 R14.1
  Bottom 1.016: P3.2 Q3.3
N$27
  Bottom 0.508: Q2.1 28.25,18.35 28,18.1 28,15.7 28.3,15.4 R14.2
N$28
  Bottom 0.508: R15.1 33.03,23.64 33.56,23.12 33.56,21.51 Q4.1 31.55,20.65 31.05,20.15 Q2.3
N$29
  Bottom 0.254: 29.95,20.25 30.32,19.88 30.32,18.78 30.73,18.37 31.37,18.37 31.97,18.98 31.97,19.57 32.3,19.9 33.8,19.9 34.8,20.9 Q4.3
  Bottom 0.508: R17.1 R16.1 30.75,21.05 29.95,20.25 Q2.2
N$30  (via drill 0.35)
  Top 0.152: U2.4 22.34,34.89 22.34,27.2 v22.24,27.1
  Bottom 0.152: C24.1 22.95,28.9 21.35,27.3 21.35,26.95 21.6,26.7 21.84,26.7 v22.24,27.1
N$31
  Bottom 0.254: U8.2 U8.3 35.05,61 35.4,61 35.4,61.19 35.09,61.5
  Bottom 0.61: U8.1 U8.2 35.05,61.5 35.09,61.5
  Bottom 1.27: 35.09,61.5 37.68,61.5 38.28,60.89 L4.1
N$33
  Bottom 0.152: R36.1 32.94,58.9 34.5,58.9 34.8,59.2 U8.4
N$34
  Bottom 0.254: U8.9 31.1,60.25 C31.1
N$35
  Bottom 0.508: R20.1 30.52,2.52 34.1,6.1 Q6.3
  Bottom 1.016: P4.2 Q6.3
N$36
  Bottom 0.508: Q1.1 27.1,5.3 26.7,4.9 26.7,2.8 26.98,2.52 R20.2
N$37
  Bottom 0.254: Q1.3 30.24,6.74 30.24,7.47 31,8.23 31,9.9 31.75,10.65 Q5.1 34.65,10.65 35,11 35,12.1 34.3,12.8 33.6,12.8 33.05,13.35 R21.1
N$38
  Bottom 0.254: R23.1 29.37,11.6 Q5.3
  Bottom 0.508: R23.1 R22.1 27.65,8.42 Q1.2
N$40
  Bottom 0.508: Q9.3 5.9,6.5 8.4,4 R26.1
  Bottom 1.016: P5.1 Q9.3
N$41
  Bottom 0.254: R26.2 13.1,4 13.3,4.2 13.3,6.9 13,7.2 Q7.1
N$42
  Bottom 0.254: R27.1 7.6,14 8,13.6 Q8.1 8.55,12.55 8.9,12.2 8.9,10.2 8.6,9.9 7.61,9.9 7.27,9.57 7.27,6.53 7.55,6.25 Q7.3
N$43
  Bottom 0.254: R29.1 12.9,2.5 13.8,3.4 13.8,8 13.3,8.5 R28.1 12.25,8.35 11.62,7.72 11.62,6.03 Q7.2 7.9,5.3 6.8,6.4 6.8,9.9 5.9,10.8 Q8.3
N$44
  Bottom 1.016: R24.1 P5.2
N$45  (via drill 0.35)
  Top 0.152: U2.1 21.4,33.71 21.4,33.26 20.51,32.37 v20.41,32.37
  Bottom 0.152: v20.41,32.37 19.71,32.37 19.15,31.81 C26.2 18.75,30.9 Y2.P$2
N$46  (via drill 0.35)
  Top 0.152: U2.2 21.7,34.12 21.7,32.65 v21.43,32.37
  Bottom 0.152: Y2.P$1 20.85,29.9 C14.2 20.85,31.79 v21.43,32.37
N$47
  Bottom 0.508: Q12.3 5.22,17.08 6.5,15.8 R32.1
  Bottom 1.016: P6.1 Q12.3
N$48
  Bottom 0.254: R32.2 11.6,15.8 11.9,16.1 11.9,20.1 11.56,20.44 Q10.1
N$49
  Bottom 0.254: Q10.3 8.1,20.34 8.1,22.3 7.93,22.47 Q11.1
  Bottom 0.508: R33.1 6.96,23.74 7.35,23.35 Q11.1
N$50
  Bottom 0.254: R35.1 10,20.85 10,19.2 10.66,18.54 Q10.2 11.01,18.5 8.65,18.5 8.17,18.98 8.17,19.45 7.89,19.73 6.67,19.73 5.3,21.1 5.3,21.47 Q11.3
  Bottom 0.508: R34.1 R35.1
N$51
  Bottom 1.016: R30.1 3.49,21.71 P6.2
NRESET
  Top 0.152: U7.19 7.3,57.06 7.3,57.23 8.68,58.6 11.82,58.6 21.1,49.32 21.1,43.28 U2.23
PY1  (via drill 0.35)
  Top 0.152: U2.16 23.67,40.9 24.66,40.9 28.65,36.91 28.65,14.35 29.1,13.9 v29.4,13.9
  Bottom 0.152: v29.4,13.9 29.9,14.4 29.9,16.4 30.4,16.9 R13.1
  Bottom 0.508: Q3.1 32.45,16.9 R13.1
PY2  (via drill 0.35)
  Top 0.152: U2.15 23.88,40.41 24.73,40.41 28.35,36.78 28.35,8.25 29.4,7.2 v30.9,7.2
  Bottom 0.152: v30.9,7.2 31.95,7.2 Q6.1
  Bottom 0.508: Q6.1 32,5.2 30.78,3.98 R19.1
PY3  (via drill 0.35)
  Top 0.152: U2.29 17.89,42.17 17.89,42.54 v17.55,42.89
  Route2 0.152: v11.9,11.3 14.51,13.91 14.51,42.17 15.54,43.2 16.3,43.2 16.5,43 17.44,43 v17.55,42.89
  Bottom 0.152: R25.1 10.55,10.85 11,11.3 v11.9,11.3
  Bottom 0.508: Q9.1 8.75,9.05 9.7,10 R25.1
PY4  (via drill 0.35)
  Top 0.152: v16.87,43.7 17.6,43.7 18.2,43.1 18.2,42.57 U2.28
  Route2 0.152: v16.87,43.7 15.7,43.7 15.3,44.1 14.54,44.1 14.21,43.76 14.21,24.7 10.91,21.4 5.4,21.4 4.9,20.9 4.9,20.61 v4.88,20.59
  Bottom 0.152: Q12.1 6.85,19.05 5.71,20.19 5.28,20.19 v4.88,20.59 | R31.1 8.74,17.26
  Bottom 0.508: Q12.1 7.32,18.68 8.74,17.26
RDYN
  Top 0.152: U7.16 9.82,57.8 12.19,57.8 20.8,49.2 20.8,43.69 U2.24
REQN
  Top 0.152: U7.12 11.35,56.5 12.2,56.5 19.1,49.6 19.1,43.79 U2.25
RESET  (via drill 0.35 pad 0.55)
  Top 0.152: U2.40 14.54,35.31 SW1.1 14.54,31.44 | SW1.3 14.54,31.4 14.54,31.44 | v15.3,32.2 14.54,31.44
  Bottom 0.152: v15.3,32.2 17.02,33.91 U$10.PIN
SCK  (via drill 0.35)
  Top 0.152: U7.11 11.64,56.08 12.18,56.08 18.8,49.47 18.8,47.59 17.8,46.6 17.8,45.9 18,45.7 v18.49,45.7 | U2.20 23,43.06 v23,43.2 23.8,43.99 33.2,43.99 v33.3,44.1
  Bottom 0.152: U3.6 3.54,36.56 5.89,34.2 14.26,34.2 14.7,34.65 14.7,35.5 15.6,36.4 16.45,36.4 23,42.95 v23,43.2 20.5,45.7 v18.49,45.7 | U$5.CLK 33.91,45.11 33.7,44.9 33.7,44.5 v33.3,44.1
SCL  (via drill 0.35)
  Top 0.152: U2.32 16.52,41.42 v16.52,41.58 | v21,52.8 21.8,53.6 25.4,53.6 26.57,54.77 U5.8 27.6,56.8 27.8,57 27.8,59.9 27.2,60.51 20.37,60.51 19.7,59.83 19.7,58.4 19.3,58 U6.8
  Bottom 0.152: v16.52,41.58 16.31,41.78 16.31,42.75 15.81,43.25 15.81,43.79 15.3,44.29 15.3,45.07 20.32,50.09 20.32,51.9 | R6.1 20.32,53.59 20.32,51.9 | 20.32,51.9 21,52.58 v21,52.8
SD-CS  (via drill 0.35)
  Top 0.152: U2.47 18.9,34.72 18.9,34.3 19.9,33.3 19.9,32.8 19.3,32.2 18.7,32.2 v18.4,32.5 | v31.93,42.91 26.01,42.91 v25.7,42.6
  Route15 0.152: v18.4,32.5 18.3,32.6 18.3,33.2 25.7,40.6 v25.7,42.6
  Bottom 0.152: U$5.CD/DAT3 33.03,41.81 v31.93,42.91
SDA  (via drill 0.35)
  Top 0.152: v15.7,42.5 15.8,42.4 16.75,42.4 17.21,41.94 17.21,41.44 U2.31 | U5.7 25.32,56.02 24.5,55.2 18.9,55.2 v18.8,55.1 18.8,56.24 U6.9
  Bottom 0.152: 19.2,54.3 19.2,53.2 20.02,52.38 20.02,50.22 15,45.2 15,44.16 15.5,43.66 15.5,42.7 v15.7,42.5 | 19.2,54.3 19.2,54.48 R5.1 | 19.2,54.3 18.8,54.7 v18.8,55.1
SWCLK  (via drill 0.35)
  Top 0.152: U2.45 17.8,35.03 v17.8,33.9
  Bottom 0.152: v17.8,33.9 18.2,33.5 18.8,33.5 19.02,33.72 U$9.PIN
SWDIO  (via drill 0.35)
  Top 0.152: U2.46 18.5,35.03 18.5,33.73 v19.2,33.04
  Bottom 0.152: v19.2,33.04 20.24,33.04 21.02,33.81 U$8.PIN
TVCX
  Top 0.152: U2.11 25.31,36.88 25.31,10.26 23.75,8.7 18.89,8.7 M1.1
TVCY
  Top 0.152: U2.12 25.66,37.23 25.66,10.18 23.78,8.3 21.25,8.3 M2.1
USB+  (via drill 0.35)
  Top 0.152: v6.59,43.51 J1.3 | U2.34 12.61,43.92 v12.49,43.92
  Bottom 0.152: U$15.PIN 4.99,43.51 v6.59,43.51 7,43.92 v12.49,43.92
USB-  (via drill 0.35)
  Top 0.152: v5.68,44.16 J1.2 | U2.33 13.8,43.43 13.8,44.2 13.17,44.83 v12.5,44.83
  Bottom 0.152: U$11.PIN 3.33,45.1 4.74,45.1 v5.68,44.16 6.56,44.16 7.23,44.83 v12.5,44.83
VOLTAGE  (via drill 0.35)
  Top 0.152: U2.10 24.9,36.58 24.9,25.23 v24.7,25.03
  Bottom 0.152: v24.7,25.03 24.7,24.5 25.1,24.1 30.6,24.1 32.04,25.54 R1.2
  Bottom 0.508: R1.2 R2.2

### Text on the board
tPlace: OFF | ON | + | + | Z | - | B | - | + | + | P4 | P1 | - | - | + | + | X | Y | E | P3 | P2 | - | - | S | S | + | + | - | -